# Altium project BRD4270Z.PrjPcb
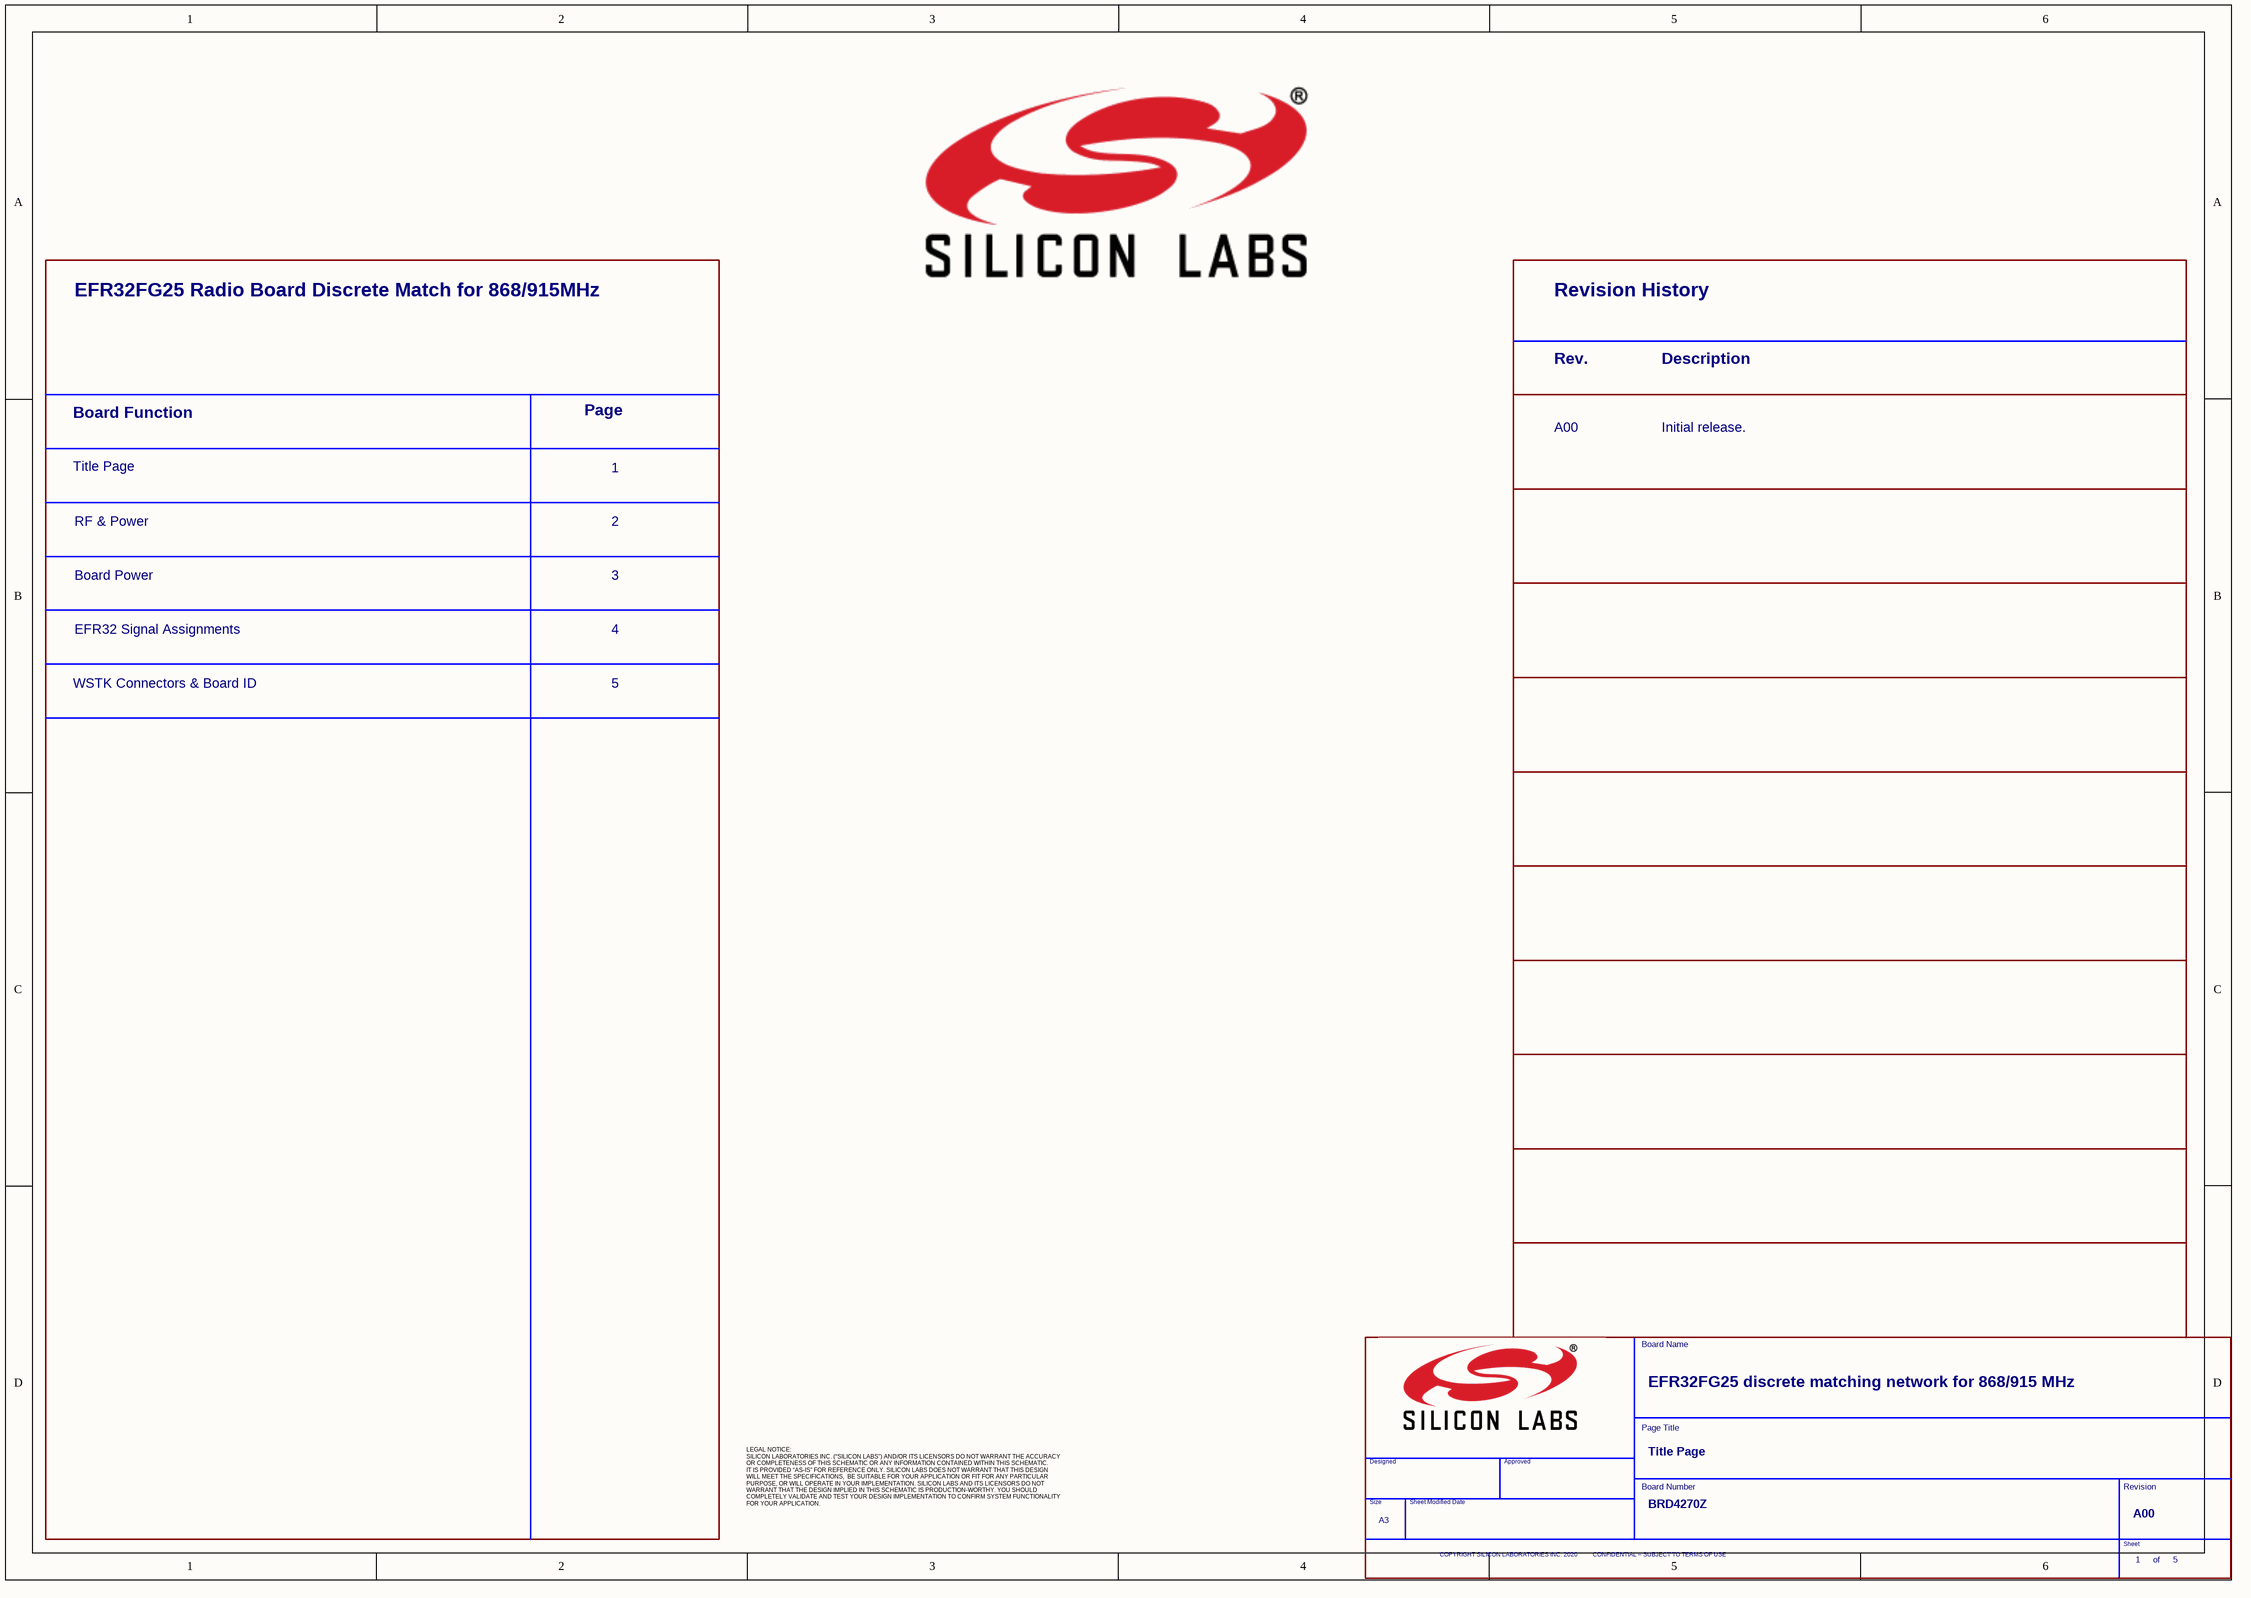
[diagram p0: 01_ Title Page.SchDoc]
5 sheets, 112 parts. Net scope: global (net labels, ports and power ports of the same name join across sheets).
Board file: PCB4270Z_A00.PcbDoc
Sheets:
  01_ Title Page.SchDoc
  02_ RF & Power.SchDoc
  03_ Board Power.SchDoc
  04_ EFR32 Signal Assign.SchDoc
  05_ WSTK Connectors & B.SchDoc

## Sheet 01_ Title Page.SchDoc
size 420 x 297 mm

### Parts
(Parts that share a designator on the sheet are numbered #1, #2 ... from top to bottom, then left to right.)
*#1  Header A: EFR32FG25 Radio Board Discrete Match for 868/915MHz  (hidden comment: Toc_Header)  (graphical)
*#2  Rev1: A00  Dscr1A: Initial release.  (hidden comment: Rev_History)  (graphical)
*#3  Title: EFR32FG25 discrete matching network for 868/915 MHz  Page Count: 5  Page Number: 1  Page Size: A3  Page Title: Title Page  Board Number: BRD4270Z  RevCode: A00  (hidden comment: TitleBlock_SiliconLabs_A3)  (graphical)

### Notes on the sheet
- Board Function
- Page
- Title Page
- RF & Power
- 1
- 2
- Board Power
- 3
- EFR32 Signal Assignments
- 4
- WSTK Connectors & Board ID
- 5
- LEGAL NOTICE:
  SILICON LABORATORIES INC. (“SILICON LABS”) AND/OR ITS LICENSORS DO NOT WARRANT THE ACCURACY
  OR COMPLETENESS OF THIS SCHEMATIC OR ANY INFORMATION CONTAINED WITHIN THIS SCHEMATIC.
  IT IS PROVIDED “AS-IS” FOR REFERENCE ONLY. SILICON LABS DOES NOT WARRANT THAT THIS DESIGN
  WILL MEET THE SPECIFICATIONS,  BE SUITABLE FOR YOUR APPLICATION OR FIT FOR ANY PARTICULAR
  PURPOSE, OR WILL OPERATE IN YOUR IMPLEMENTATION. SILICON LABS AND ITS LICENSORS DO NOT
  WARRANT THAT THE DESIGN IMPLIED IN THIS SCHEMATIC IS PRODUCTION-WORTHY. YOU SHOULD
  COMPLETELY VALIDATE AND TEST YOUR DESIGN IMPLEMENTATION TO CONFIRM SYSTEM FUNCTIONALITY
  FOR YOUR APPLICATION.
- (in symbol Rev_History) Revision History; Rev.; Description
- (in symbol TitleBlock_SiliconLabs_A3) Board Name; Page Title; Designed; Approved; Board Number; Revision; Size; Sheet Modified Date; Sheet; COPYRIGHT SILICON LABORATORIES INC. 2020          CONFIDENTIAL – SUBJECT TO TERMS OF USE; of

### Library data of the parts
*#2 = Rev_History: RevCode: PA00*
*#3 = TitleBlock_SiliconLabs_A3: OrgName: Silicon Labs

## Sheet 02_ RF & Power.SchDoc
size 420 x 297 mm
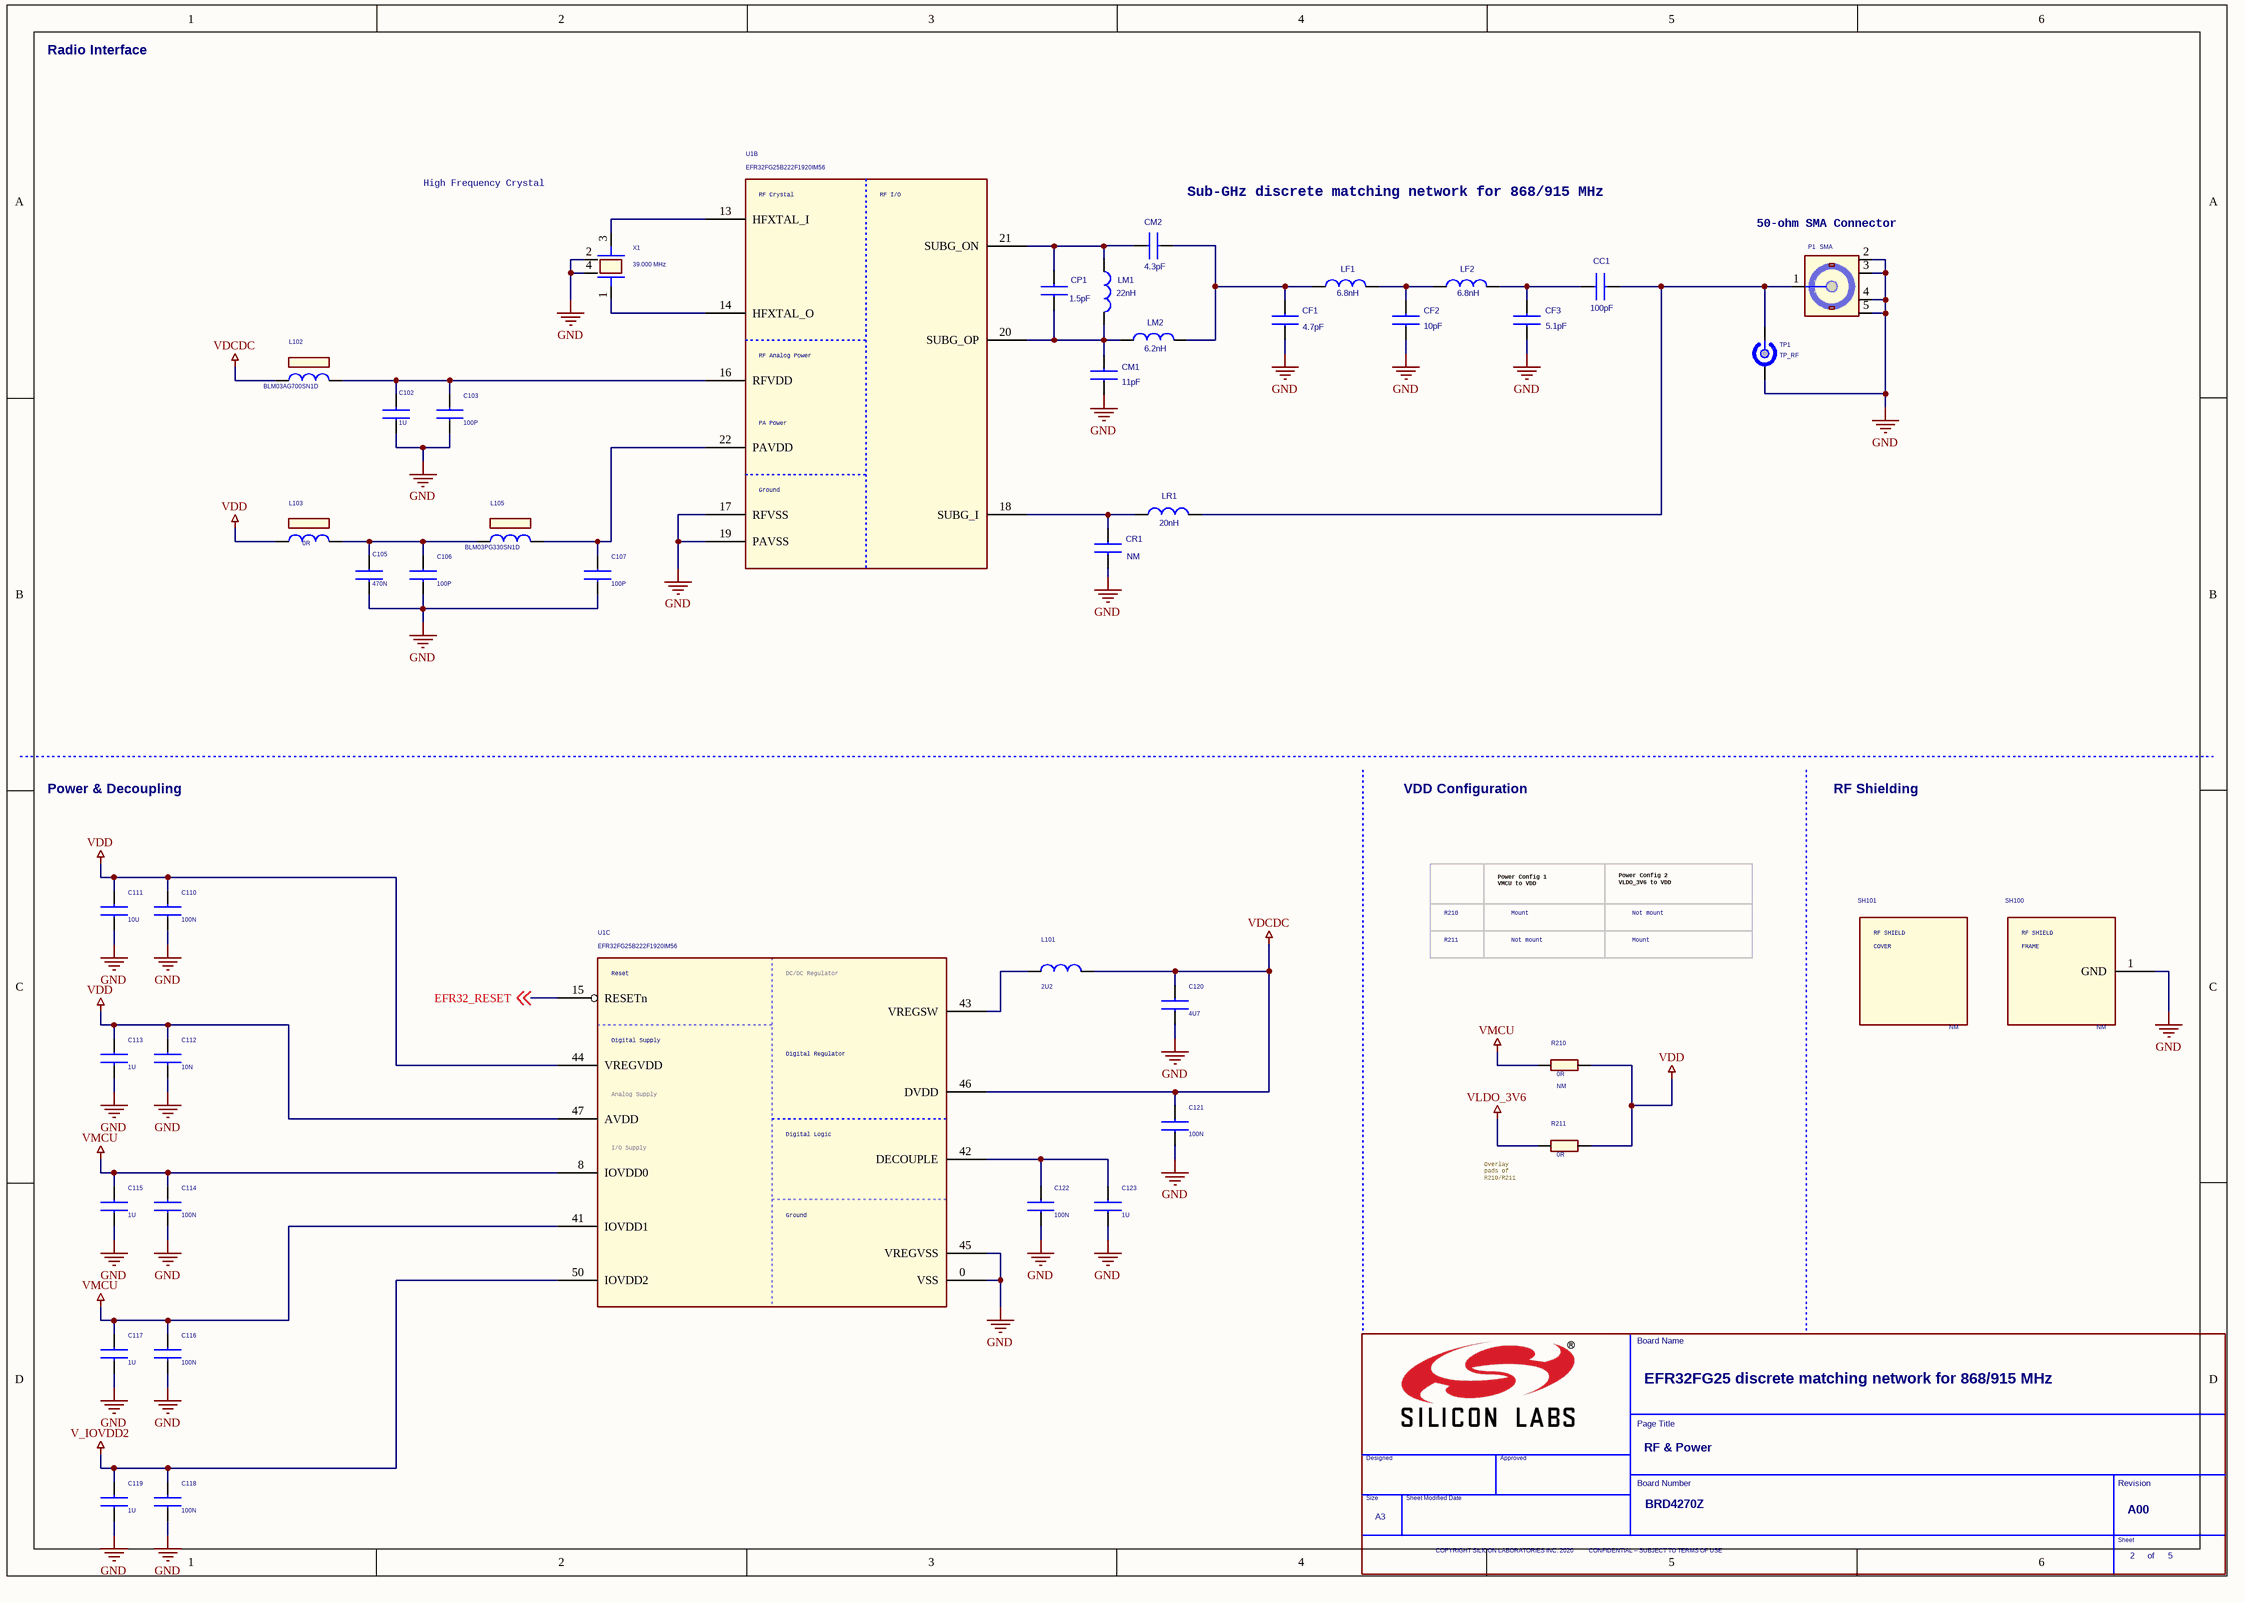
[diagram p1: 02_ RF & Power.SchDoc]

### Parts
(Parts that share a designator on the sheet are numbered #1, #2 ... from top to bottom, then left to right.)
*#4  Title: EFR32FG25 discrete matching network for 868/915 MHz  Page Count: 5  Page Number: 2  Page Size: A3  Page Title: RF & Power  Board Number: BRD4270Z  RevCode: A00  (hidden comment: TitleBlock_SiliconLabs_A3)  (graphical)
C102  1U  [C0402_L]
C103  100P  [C0201_L]
C105  470N  [C0402_L]
C106  100P  [C0201_L]
C107  100P  [C0201_L]
C110  100N  [C0201_L]
C111  10U  [C0603_L]
C112  10N  [C0201_L]
C113  1U  [C0402_L]
C114  100N  [C0201_L]
C115  1U  [C0402_L]
C116  100N  [C0201_L]
C117  1U  [C0402_L]
C118  100N  [C0201_L]
C119  1U  [C0402_L]
C120  4U7  [C0603_L]
C121  100N  [C0201_L]
C122  100N  [C0201_L]
C123  1U  [C0402_L]
CC1  100pF  [C0201_L]
CF1  4.7pF  [C0201_L]
CF2  10pF  [C0201_L]
CF3  5.1pF  [C0201_L]
CM1  11pF  [C0201_L]
CM2  4.3pF  [C0201_L]
CP1  1.5pF  [C0201_L]
CR1  Not Mounted: NM  [C0201_L]  (hidden comment: Unused)
L101  2U2  [COIL_1008_L]
L102  BLM03AG700SN1D  [COIL_MUR_BLM03_0201]
L103  0R  [COIL_MUR_BLM03_0201]
L105  BLM03PG330SN1D  [COIL_MUR_BLM03_0201]
LF1  6.8nH  [COIL_0201_L]
LF2  6.8nH  [COIL_0201_L]
LM1  22nH  [COIL_0201_L]
LM2  6.2nH  [COIL_0201_L]
LR1  20nH  [COIL_0201_L]
P1  SMA  [TE_SMA_1814832_TH_VER]
R210  0R  Not Mounted: NM  [R0402_L]
R211  0R  [R0402_L]
SH100  Not Mounted: NM  [LAIRD_BMI-S-203-F]  (hidden comment: RF_SHIELD_FRAME_BMI-S-203-F)
SH101  Not Mounted: NM  (hidden comment: RF_SHIELD_COVER_BMI-S-203-C)
TP1  TP_RF  [TP_INGUN_50OHM_PARTIAL]
U1  EFR32FG25B222F1920IM56  [QFN56_M040_7.0X7.0_EP_SL]  (parts B,C of 3)
X1  39.000 MHz  [X_SSS_DSX211SH_2.05X1.65-4]

### Nets
GND: C102.2 C103.2 C105.2 C106.2 C107.2 C110.2 C111.2 C112.2 C113.2 C114.2 C115.2 C116.2 C117.2 C118.2 C119.2 C120.2 C121.2 C122.2 C123.2 CF1.2 CF2.2 CF3.2 CM1.2 CR1.2 P1.2(GND1) P1.3(GND2) P1.4(GND3) P1.5(GND4) SH100.1(GND) TP1.2(GND) U1.0(VSS) U1.17(RFVSS) U1.19(PAVSS) U1.45(VREGVSS) X1.2 X1.4
V_IOVDD2: C118.1 C119.1 U1.50(IOVDD2)
VDCDC: C120.1 C121.1 L101.2 L102.1 U1.46(DVDD)
VDD: C110.1 C111.1 C112.1 C113.1 L103.1 R210.2 R211.2 U1.44(VREGVDD) U1.47(AVDD)
VLDO_3V6: R211.1
VMCU: C114.1 C115.1 C116.1 C117.1 R210.1 U1.8(IOVDD0) U1.41(IOVDD1)
EFR32_RESET: U1.15(RESETn) ; off-sheet EFR32_RESET  [project net DBG_RESET]
NetC102_1: C102.1 C103.1 L102.2 U1.16(RFVDD)
NetC105_1: C105.1 C106.1 L103.2 L105.1
NetC107_1: C107.1 L105.2 U1.22(PAVDD)
NetC122_1: C122.1 C123.1 U1.42(DECOUPLE)
NetCC1_1: CC1.1 CF3.1 LF2.2
NetCC1_2: CC1.2 LR1.2 P1.1(SIGNAL) TP1.1(RF)
NetCF1_1: CF1.1 CM2.2 LF1.1 LM2.2
NetCF2_1: CF2.1 LF1.2 LF2.1
NetCM1_1: CM1.1 CP1.2 LM1.2 LM2.1 U1.20(SUBG_OP)
NetCM2_1: CM2.1 CP1.1 LM1.1 U1.21(SUBG_ON)
NetCR1_1: CR1.1 LR1.1 U1.18(SUBG_I)
NetL101_1: L101.1 U1.43(VREGSW)
NetU1_13: U1.13(HFXTAL_I) X1.3
NetU1_14: U1.14(HFXTAL_O) X1.1

### Notes on the sheet
- Radio Interface
- High Frequency Crystal
- (near CM2) Sub-GHz discrete matching network for 868/915 MHz
- (near P1) 50-ohm SMA Connector
- Power & Decoupling
- VDD Configuration
- RF Shielding
- R210
- Power Config 1
  VMCU to VDD
- Mount
- Power Config 2
  VLDO_3V6 to VDD
- Not mount
- R211
- (near R211) Overlay
  pads of
  R210/R211
- (in symbol EFR32xG25_QFN56_HFCLKOUT, part B) RF Crystal; RF I/O; RF Analog Power; PA Power; Ground
- (in symbol EFR32xG25_QFN56_HFCLKOUT, part C) Reset; DC/DC Regulator; Digital Supply; Digital Regulator; Analog Supply; Digital Logic; I/O Supply; Ground
- (in symbol RF_SHIELD_COVER_BMI-S-203-C) RF SHIELD; COVER
- (in symbol RF_SHIELD_FRAME_BMI-S-203-F) RF SHIELD; FRAME
- (in symbol TitleBlock_SiliconLabs_A3) Board Name; Page Title; Designed; Approved; Board Number; Revision; Size; Sheet Modified Date; Sheet; COPYRIGHT SILICON LABORATORIES INC. 2020          CONFIDENTIAL – SUBJECT TO TERMS OF USE; of

### Library data of the parts
*#4 = TitleBlock_SiliconLabs_A3: Board Approver: RGU; OrgName: Silicon Labs
C102 C113 C115 C117 C119 C123 = C0402: Rating: 6.3V; Tolerance: 10%; Technology: X7R
C103 C106 C107 = C0201: Rating: 25V; Tolerance: 5%; Technology: C0G
C105 = C0402: Rating: 10V; Tolerance: 10%; Technology: X7R
C110 C114 C116 C118 C121 C122 = C0201: Rating: 16V; Tolerance: 20%; Technology: X7S
C111 = C0603: Rating: 6.3V; Tolerance: 20%; Technology: X7R
C112 = C0201: Rating: 16V; Tolerance: 10%; Technology: X7R
C120 = C0603: Rating: 6.3V; Tolerance: 10%; Technology: X7R
CC1 CM2 CR1 = C0201: Tolerance: ±0.05P; Mfg: Murata; Technology: C0G
CF1 CP1 = C0201: Tolerance: ±0.1P; Mfg: Murata; Mfg #: GRM0335C1H3R8BA01D; Technology: C0G
CF2 = C0201: Tolerance: ±0.1P; Mfg: Murata; Mfg #: GRM0335C1H4R0BA01D; Technology: C0G
CF3 = C0201: Tolerance: ±0.05P; Mfg: Murata; Mfg #: GRM0335C1H2R8WA01D; Technology: C0G
CM1 = C0201: Tolerance: ±0.1P; Mfg: Murata; Mfg #: GRM0335C1H9R4BA01D; Technology: C0G
L101 = L1008: Mfg: Murata; Mfg #: DFE2HCAH2R2MJ0L; Tolerance: +/-20%
L102 L105 = BLM03AX: Mfg: Murata; Price_1K: 0.05
  L102: Mfg #: BLM03AG700SN1D
  L105: Mfg #: BLM03PG330SN1D
L103 = BLM03AX: Price_1K: 0.05
LF1 = L0201: Tolerance: ±3%; Mfg #: LQP03HQ6N2H02D; Mfg: Murata
LF2 = L0201: Tolerance: ±3%; Mfg #: LQP03HQ8N2H02D; Mfg: Murata
LM1 = L0201: Tolerance: ±0.1N; Mfg #: LQP03HQ1N6B02D; Mfg: Murata
LM2 = L0201
LR1 = L0201: Tolerance: ±3%; Mfg #: LQP03HQ16NH02D; Mfg: Murata
P1 = SMA_TH_WELLSHOW: Mfg #: C02AN31P00101; Mfg: Wellshow; Price_1K: 1.46
R210 R211 = R0402: Price_1K: 0.005
SH100 = RF_SHIELD_FRAME_BMI-S-203-F: Mfg: Laird Technologies; Footprint: Laird_BMI-S-203-F; Mfg #: BMI-S-203-F; Price_1k: 1.148
SH101 = RF_SHIELD_COVER_BMI-S-203-C: Mfg: Laird Technologies; Price_1k: 0.814; Mfg #: BMI-S-203-C
U1 = EFR32xG25_QFN56_HFCLKOUT: MFG #: EFR32FG25B222F1920IM56-AR; MFG: Silicon Labs
X1 = DSX211SH: Mfg: Tai-Saw; Mfg #: TZ3541C; Price_1K: 0.512

## Sheet 03_ Board Power.SchDoc
size 420 x 297 mm
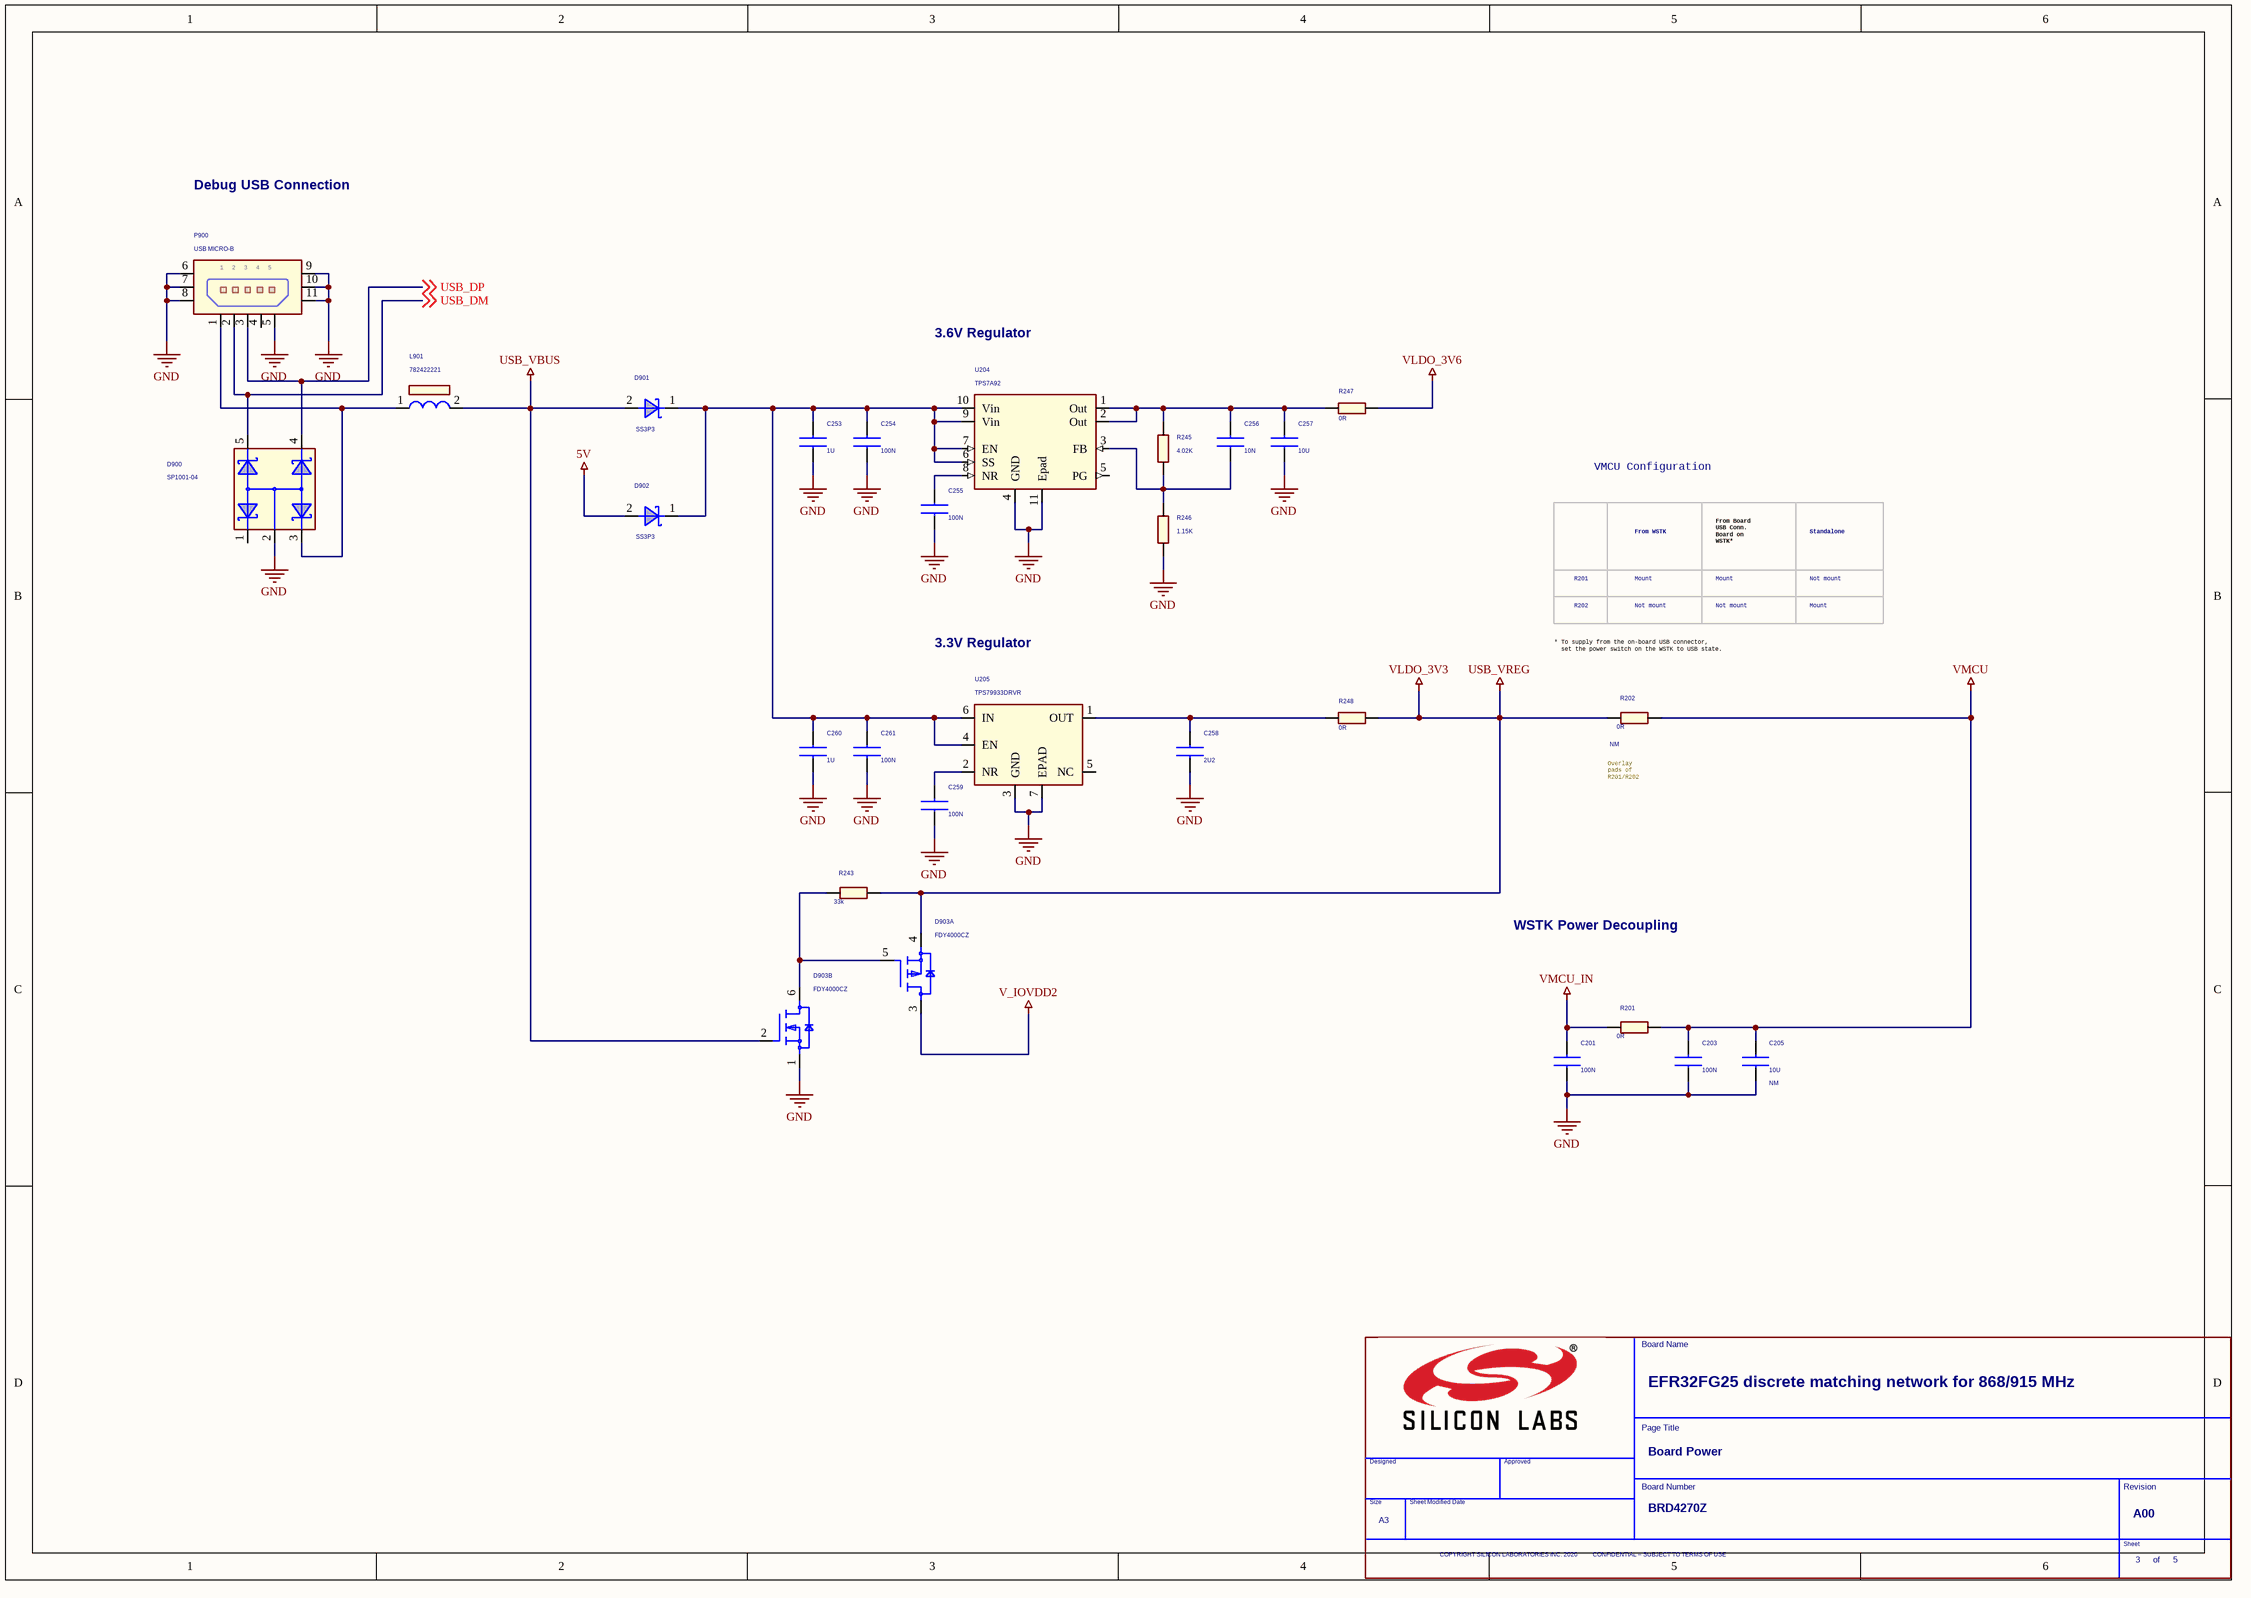
[diagram p2: 03_ Board Power.SchDoc]

### Parts
(Parts that share a designator on the sheet are numbered #1, #2 ... from top to bottom, then left to right.)
*#5  Title: EFR32FG25 discrete matching network for 868/915 MHz  Page Count: 5  Page Number: 3  Page Size: A3  Page Title: Board Power  Board Number: BRD4270Z  RevCode: A00  (hidden comment: TitleBlock_SiliconLabs_A3)  (graphical)
C201  100N  [C0201_L]
C203  100N  [C0201_L]
C205  10U  Not Mounted: NM  [T_UNDEF]
C253  1U  [C0402_L]
C254  100N  [C0201_L]
C255  100N  [C0201_L]
C256  10N  [C0201_L]
C257  10U  [C0402_L]
C258  2U2  [C0402_L]
C259  100N  [C0201_L]
C260  1U  [C0402_L]
C261  100N  [C0201_L]
D900  SP1001-04  [SOT553_L]
D901  SS3P3  [DO-220AA]
D902  SS3P3  [DO-220AA]
D903  FDY4000CZ  [SOT-563]  (parts A,B of 2)
L901  782422221  [COIL_0402]
P900  USB MICRO-B  [KLS_L-KLS1-238-0-X-0-X]
R201  0R  [R0402_L]
R202  0R  Not Mounted: NM  [R0402_L]
R243  33k  [R0402_L]
R245  4.02K  [R0201_L]
R246  1.15K  [R0201_L]
R247  0R  [R0603_L]
R248  0R  [R0603_L]
U204  TPS7A92  [WFDFN-10_EP_TPS7A92]
U205  TPS79933DRVR  [SON-6_EP_TPS79933DDCR]

### Nets
5V: D902.2(Anode)
GND: C201.2 C203.2 C205.2 C253.2 C254.2 C255.2 C257.2 C258.2 C259.2 C260.2 C261.2 D900.2 D903.1(S1) P900.5 P900.6 P900.7 P900.8 P900.9 P900.10 P900.11 R246.1 U204.4(GND) U204.11(Epad) U205.3(GND) U205.7(EPAD)
USB_VBUS: D901.2(Anode) D903.2(G1) L901.2
USB_VREG: D903.4(S2) R202.2 R243.1 R248.2  [also labelled VLDO_3V3]
V_IOVDD2: D903.3(D2)
VLDO_3V6: R247.2
VMCU: C203.1 C205.1 R201.1 R202.1
VMCU_IN: C201.1 R201.2
USB_DM: D900.5 P900.2 ; off-sheet USB_DM  [project net EFR32_PD07]
USB_DP: D900.4 P900.3 ; off-sheet USB_DP  [project net EFR32_PD06]
NetC253_1: C253.1 C254.1 C260.1 C261.1 D901.1(Cathode) D902.1(Cathode) U204.6(SS) U204.7(EN) U204.9(Vin) U204.10(Vin) U205.4(EN) U205.6(IN)
NetC255_1: C255.1 U204.8(NR)
NetC256_1: C256.1 C257.1 R245.2 R247.1 U204.1(Out) U204.2(Out)
NetC256_2: C256.2 R245.1 R246.2 U204.3(FB)
NetC258_1: C258.1 R248.1 U205.1(OUT)
NetC259_1: C259.1 U205.2(NR)
NetD900_3: D900.3 L901.1 P900.1
NetD903_5: D903.5(G5) D903.6(D1) R243.2

Not connected (* = marked no-connect by the designer): D900 1; P900 4; U204 5(PG); U205 5(NC)

### Notes on the sheet
- Debug USB Connection
- 3.6V Regulator
- VMCU Configuration
- From WSTK
- Standalone
- R201
- Mount
- From Board
  USB Conn.
  Board on
  WSTK*
- Not mount
- 3.3V Regulator
- * To supply from the on-board USB connector,
  set the power switch on the WSTK to USB state.
- R202
- (near R202) Overlay
  pads of
  R201/R202
- WSTK Power Decoupling
- (in symbol TitleBlock_SiliconLabs_A3) Board Name; Page Title; Designed; Approved; Board Number; Revision; Size; Sheet Modified Date; Sheet; COPYRIGHT SILICON LABORATORIES INC. 2020          CONFIDENTIAL – SUBJECT TO TERMS OF USE; of

### Library data of the parts
*#5 = TitleBlock_SiliconLabs_A3: Board Approver: RGU; OrgName: Silicon Labs
C201 C203 C254 C255 C259 C261 = C0201: Rating: 16V; Tolerance: 20%; Technology: X7S
C205 = CAPACITOR: Technology: X7R
C253 C258 C260 = C0402: Rating: 6.3V; Tolerance: 10%
  C253 C260: Technology: X7R
  C258: Technology: X7S
C256 = C0201: Rating: 16V; Tolerance: 10%; Technology: X7R
C257 = C0402: Rating: 6.3V; Tolerance: 20%; Technology: X6S
D900 = SP1001-04: Mfg: Littlefuse; Mfg #: SP1001-04XTG; Price_1K: 0.187
D901 D902 = SS3P3: Mfg: Vishay; Mfg #: SS3P3-M3/84A; Price_1K: 0.12
D903 = FDY4000CZ: Mfg: ON Semiconductor; Mfg #: FDY4000CZ
L901 = WE-CBA: Mfg: Würth Elektronik; Price_1K: 0.02; Mfg #: 782422221
P900 = KLS L-KLS1-238-0-0-0: Mfg: KLS; Mfg #: L-KLS1-238-0-0-0-R; Price_1K: 0.20
R201 R202 R243 = R0402: Price_1K: 0.005
R245 R246 = R0201: Price_1K: 0.005
R247 R248 = R0603: Price_1K: 0.005
U204 = TPS7A92: Mfg #: TPS7A9201DSKR; Mfg: Texas Instruments; Price 1k: 1.2
U205 = TPS79933DRVR: Mfg: Texas Instruments; Price 1k: 0.38; Mfg #: TPS79933DRVR

## Sheet 04_ EFR32 Signal Assign.SchDoc
size 420 x 297 mm
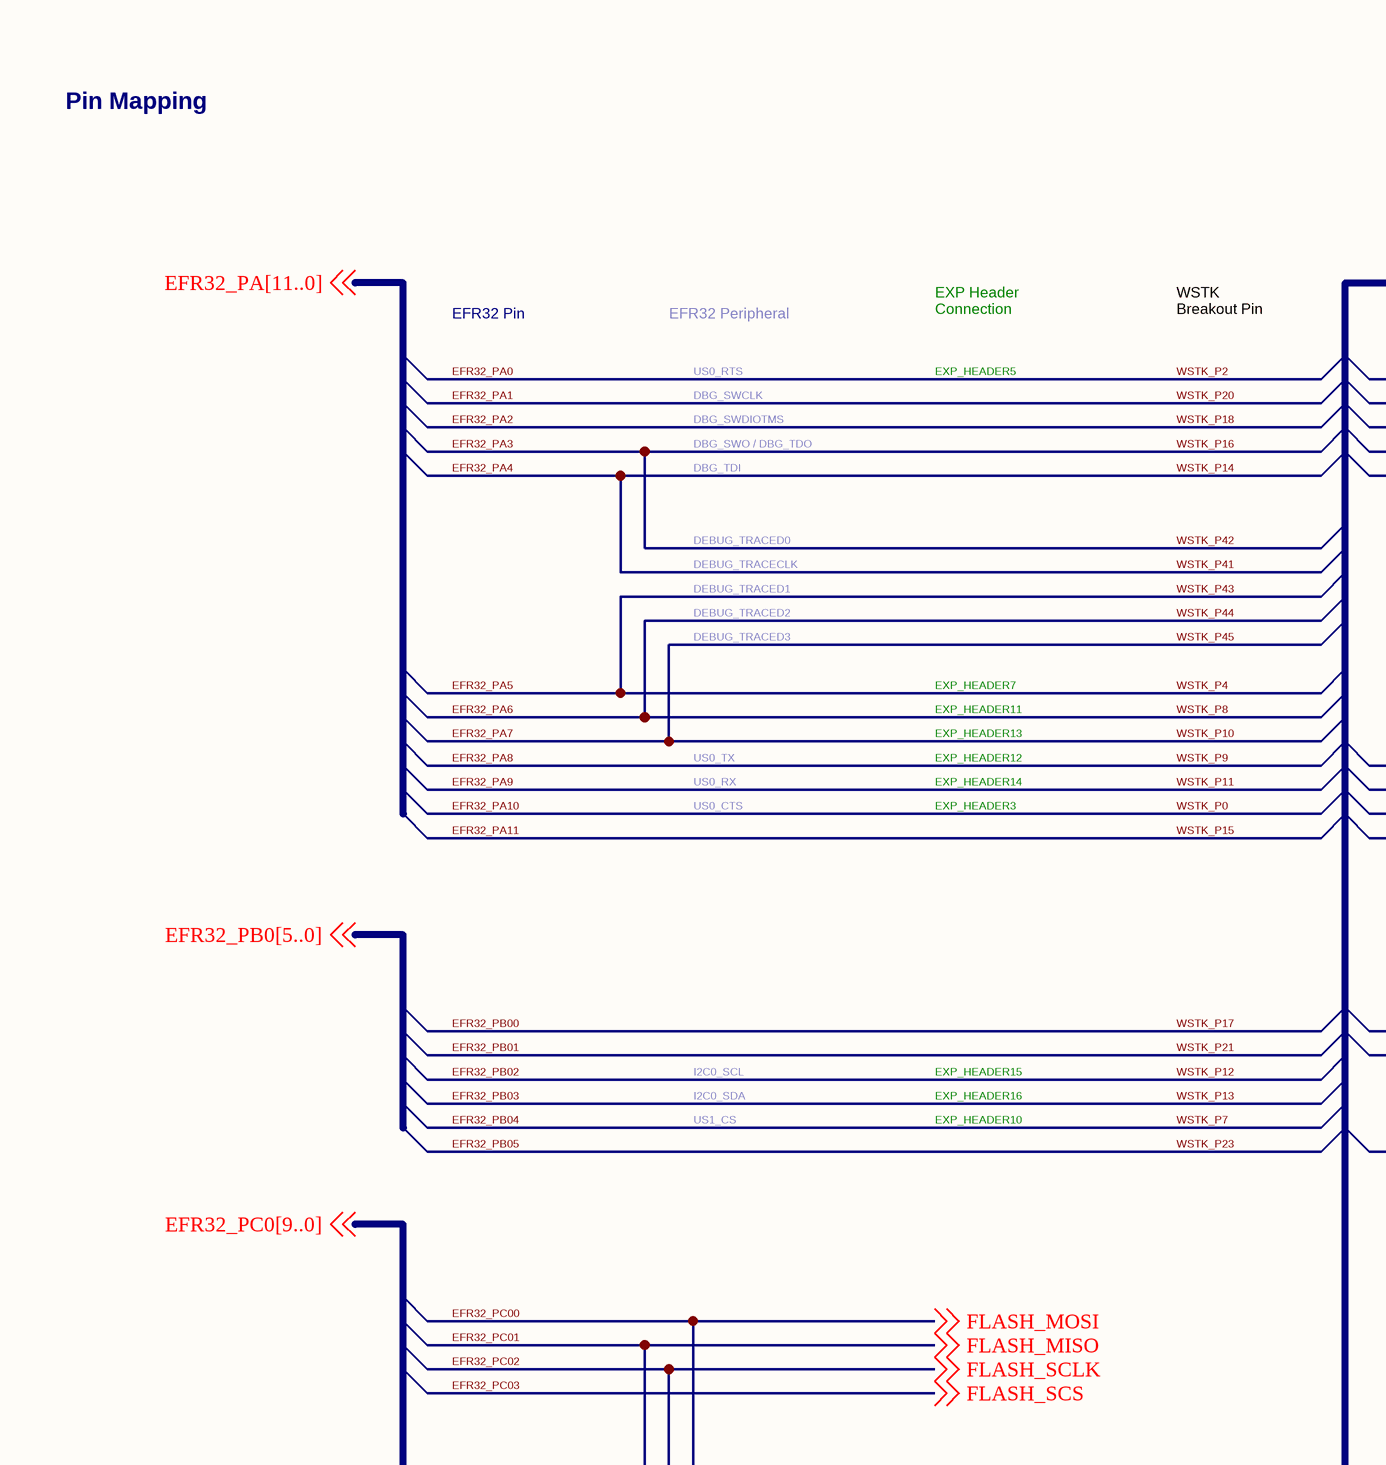
[diagram p3: 04_ EFR32 Signal Assign.SchDoc, top left]
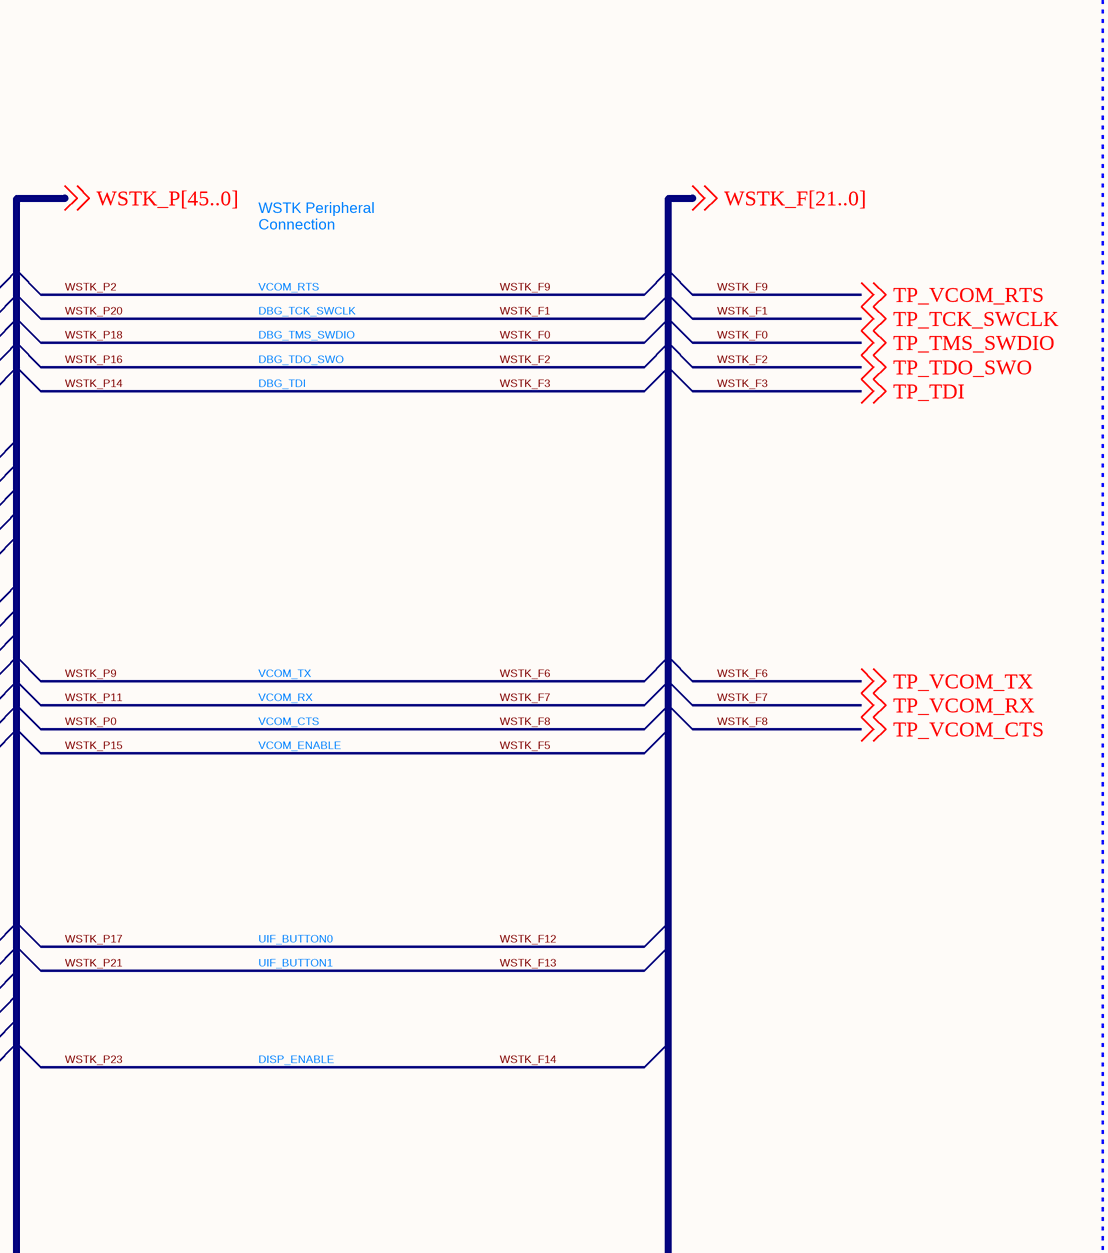
[diagram p4: 04_ EFR32 Signal Assign.SchDoc, top middle]
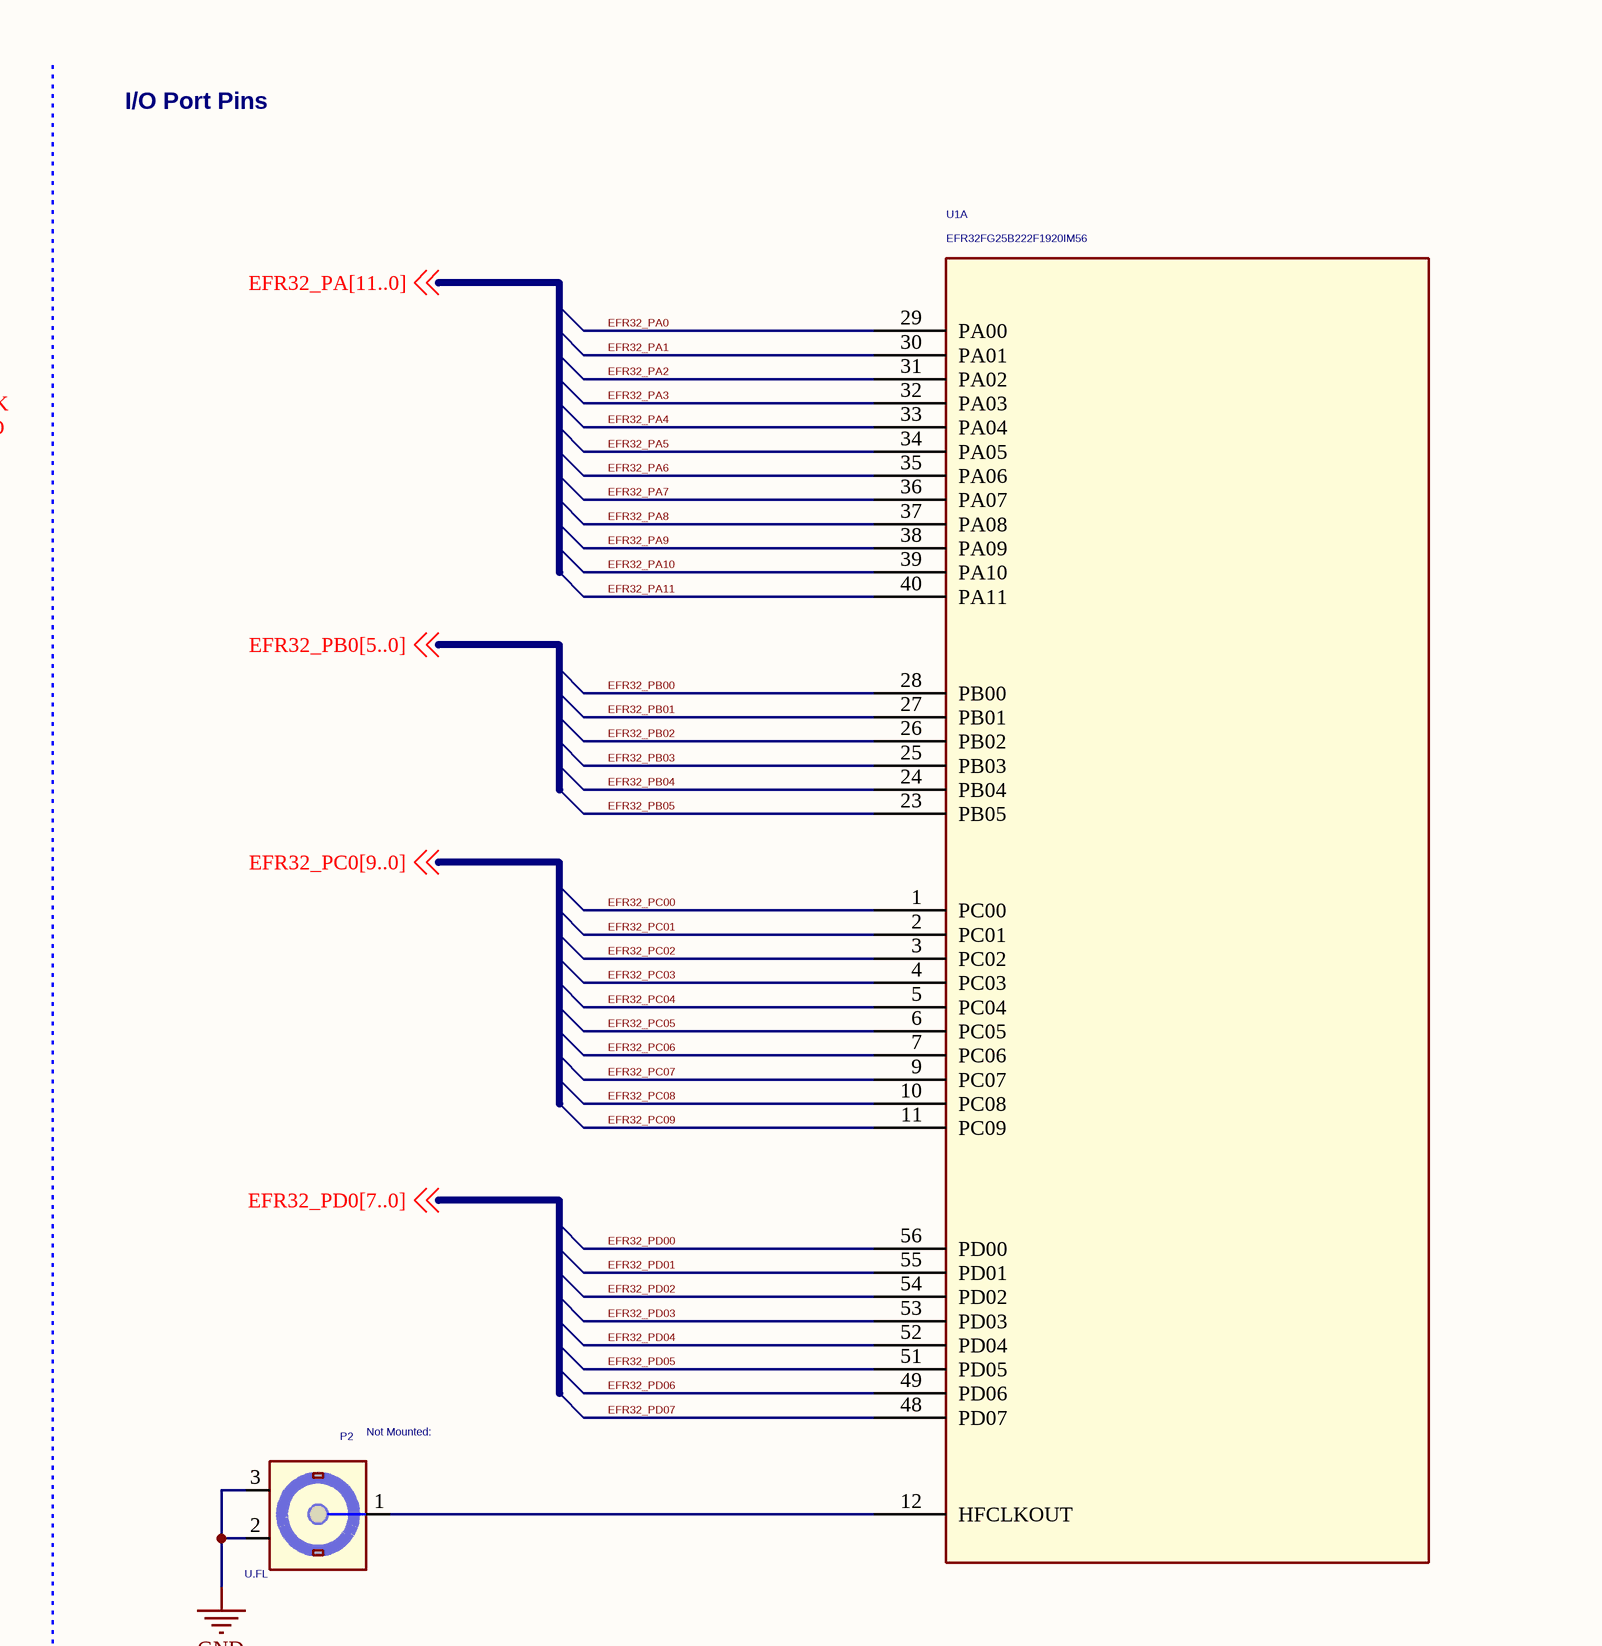
[diagram p5: 04_ EFR32 Signal Assign.SchDoc, top right]
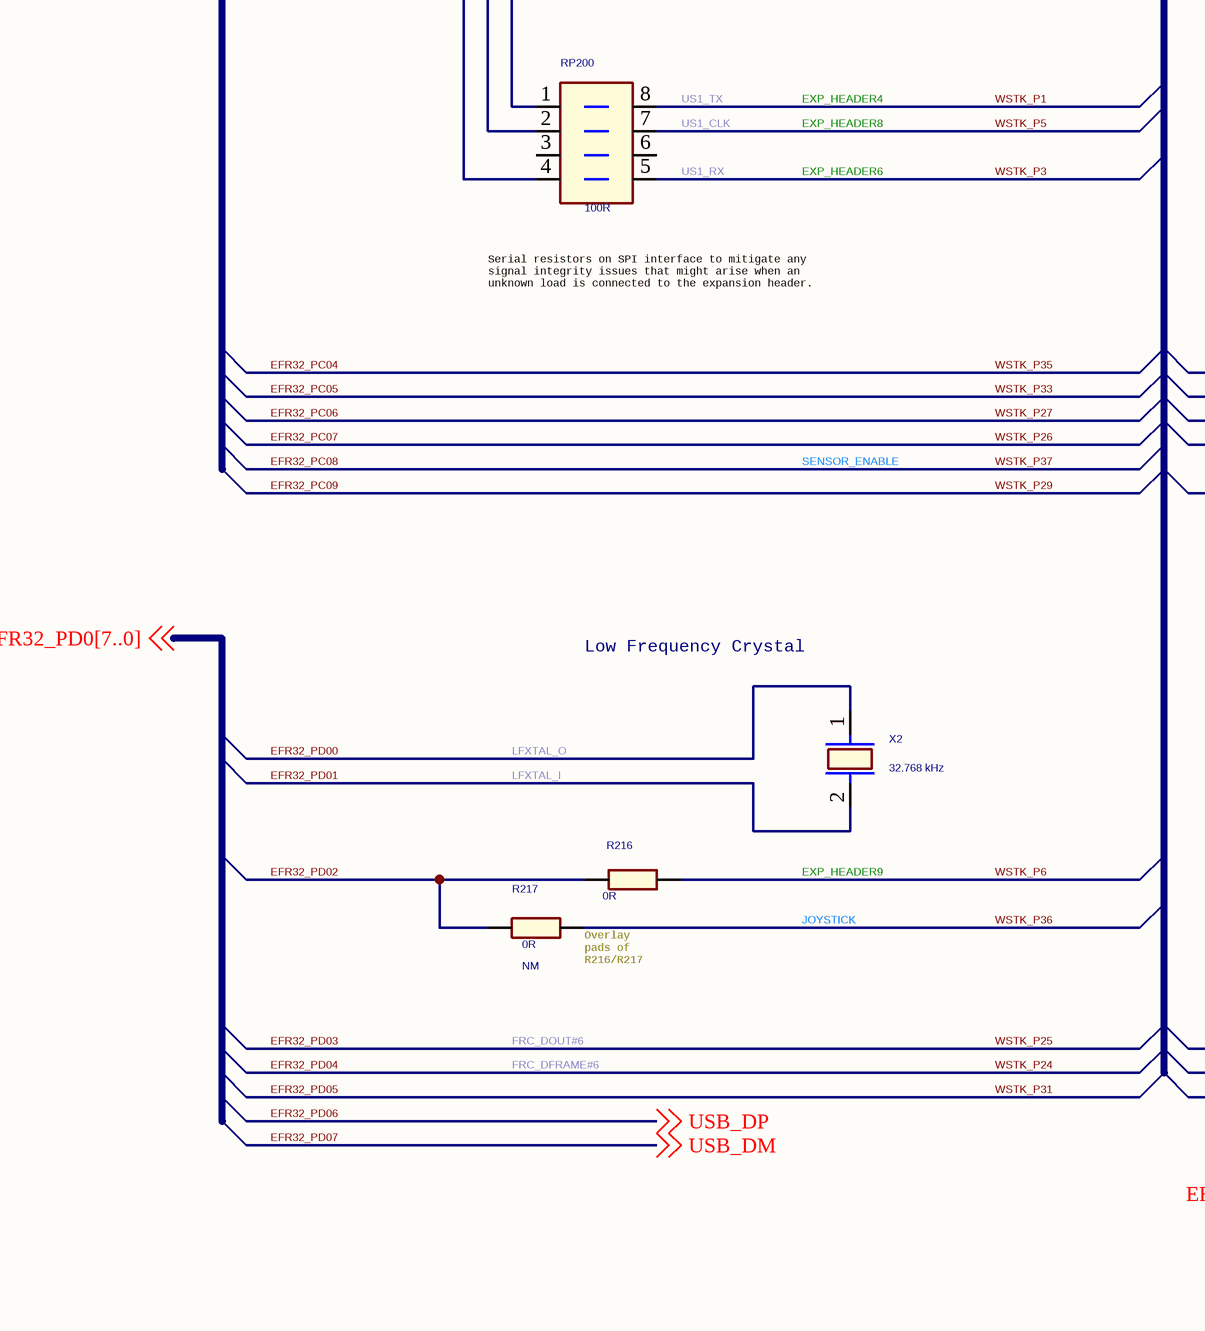
[diagram p6: 04_ EFR32 Signal Assign.SchDoc, bottom left]
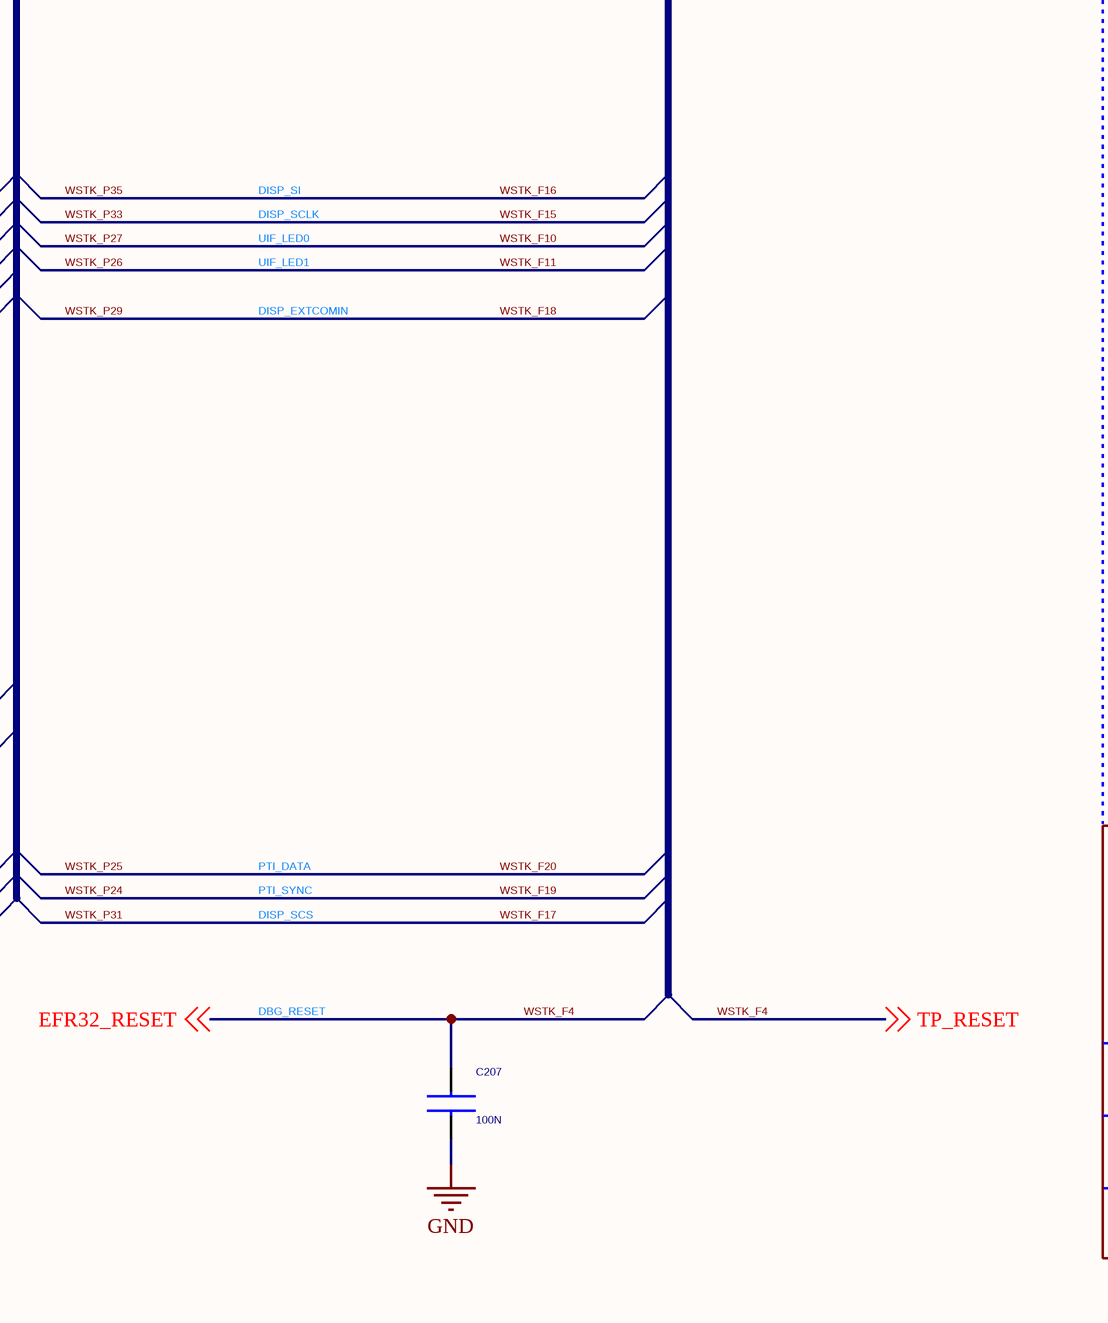
[diagram p7: 04_ EFR32 Signal Assign.SchDoc, bottom middle]
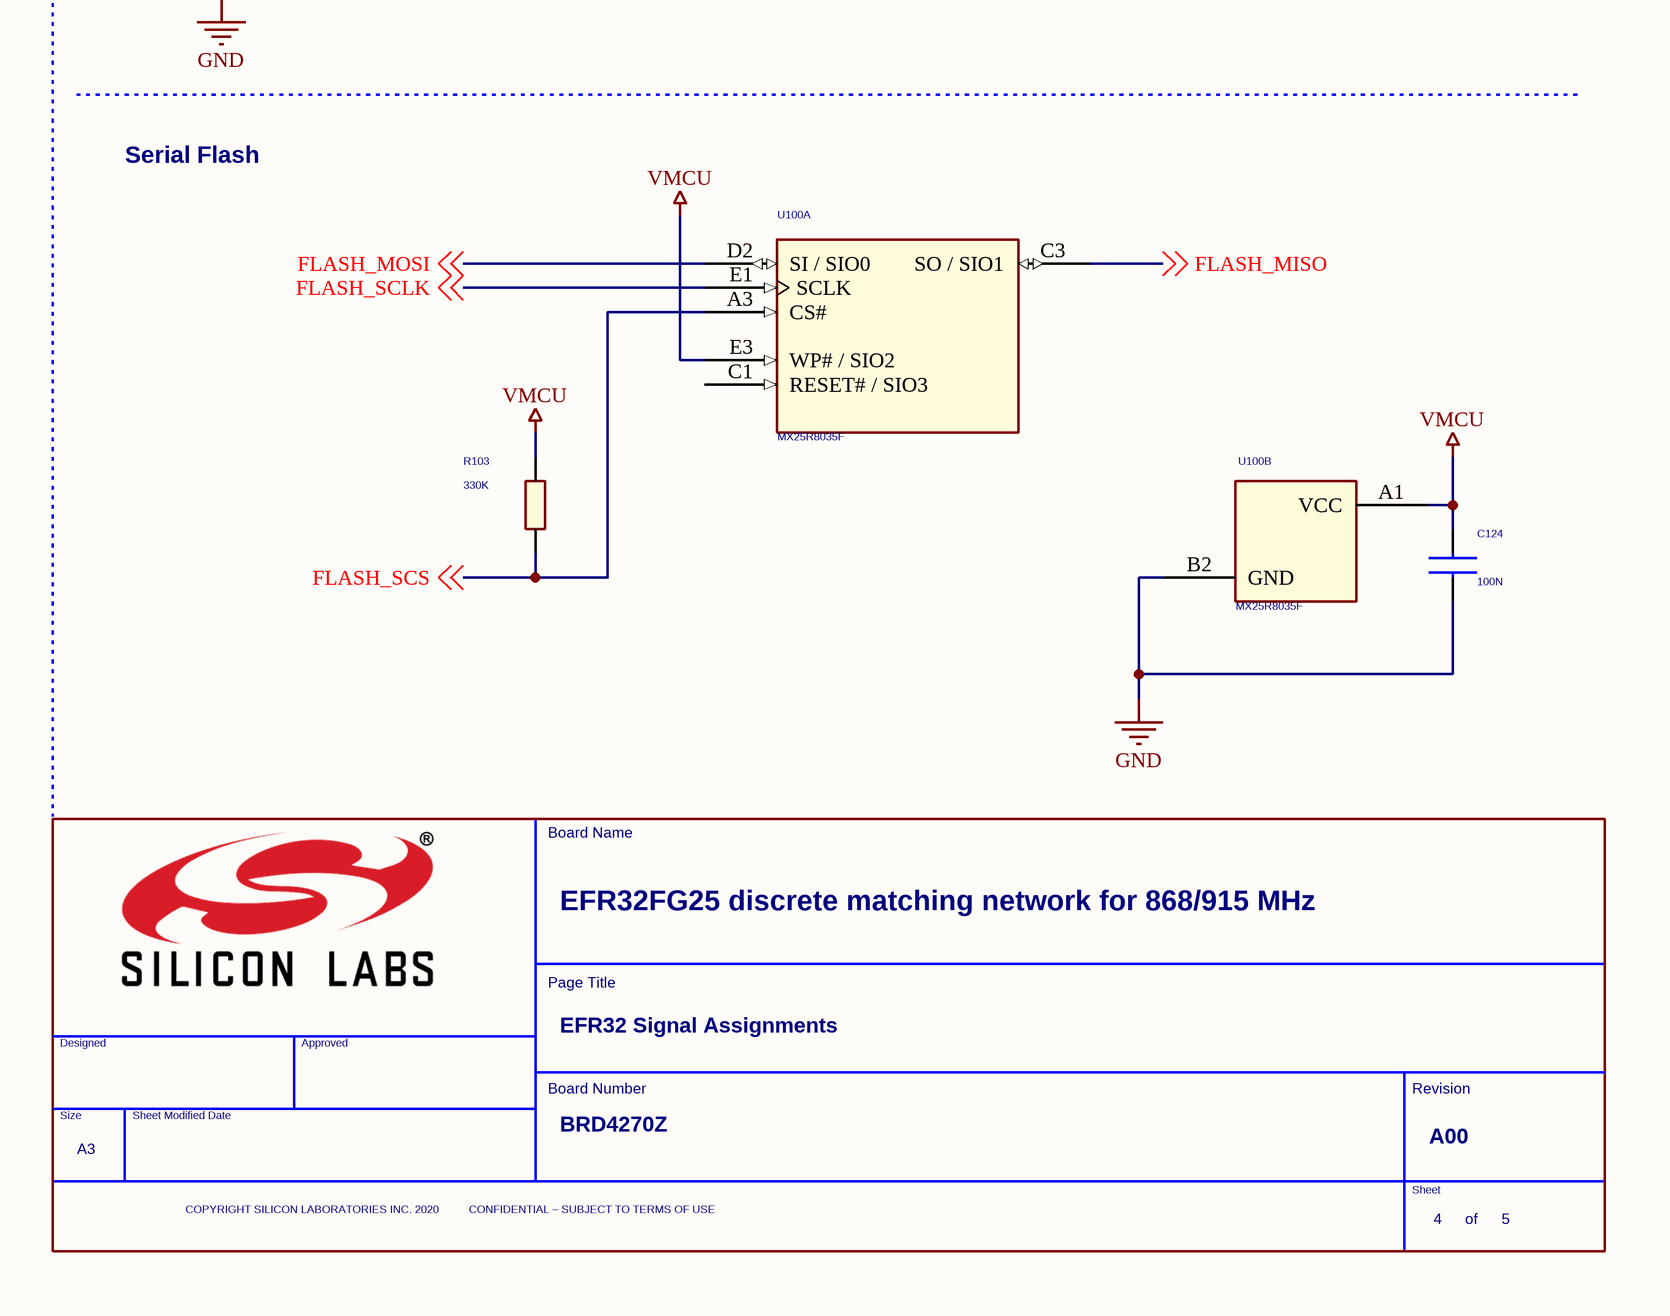
[diagram p8: 04_ EFR32 Signal Assign.SchDoc, bottom right]

### Parts
(Parts that share a designator on the sheet are numbered #1, #2 ... from top to bottom, then left to right.)
*#6  Title: EFR32FG25 discrete matching network for 868/915 MHz  Page Count: 5  Page Number: 4  Page Size: A3  Page Title: EFR32 Signal Assignments  Board Number: BRD4270Z  RevCode: A00  (hidden comment: TitleBlock_SiliconLabs_A3)  (graphical)
C124  100N  [C0201_L]
C207  100N  [C0201_L]
P2  U.FL  [HIROSE_U.FL-R-SMT-1]
R103  330K  [R0201_L]
R216  0R  [R0402_L]
R217  0R  Not Mounted: NM  [R0402_L]
RP200  100R  [RES_MNR04-8]
U1  EFR32FG25B222F1920IM56  [QFN56_M040_7.0X7.0_EP_SL]  (part A of 3)
U100  MX25R8035F  [BGA8_M040_1.24x1.75_WLCSP]  (parts A,B of 2)
X2  32.768 kHz  [X_MCS_CM8V-T1A]

### Nets
GND: C124.2 C207.2 P2.2(GND1) P2.3(GND4) U100.B2(GND)
VMCU: C124.1 R103.2 U100.A1(VCC) U100.E3(WP#_/_SIO2)
DBG_RESET: C207.1 ; off-sheet EFR32_RESET, off-sheet TP_RESET  [also labelled EFR32_RESET, TP_RESET, WSTK_F4]
DBG_SWCLK: U1.30(PA01) ; off-sheet TP_TCK_SWCLK  [also labelled DBG_TCK_SWCLK, EFR32_PA1, TP_TCK_SWCLK, WSTK_F1, WSTK_P20]
DBG_SWDIOTMS: U1.31(PA02) ; off-sheet TP_TMS_SWDIO  [also labelled DBG_TMS_SWDIO, EFR32_PA2, TP_TMS_SWDIO, WSTK_F0, WSTK_P18]
DBG_SWO / DBG_TDO: U1.32(PA03) ; off-sheet TP_TDO_SWO  [also labelled DBG_TDO_SWO, DEBUG_TRACED0, EFR32_PA3, TP_TDO_SWO, WSTK_F2, WSTK_P16, WSTK_P42]
DBG_TDI: U1.33(PA04) ; off-sheet TP_TDI  [also labelled DEBUG_TRACECLK, EFR32_PA4, TP_TDI, WSTK_F3, WSTK_P14, WSTK_P41]
DEBUG_TRACED1: U1.34(PA05)  [also labelled EFR32_PA5, EXP_HEADER7, WSTK_P4, WSTK_P43]
DEBUG_TRACED2: U1.35(PA06)  [also labelled EFR32_PA6, EXP_HEADER11, WSTK_P44, WSTK_P8]
DEBUG_TRACED3: U1.36(PA07)  [also labelled EFR32_PA7, EXP_HEADER13, WSTK_P10, WSTK_P45]
DISP_ENABLE: U1.23(PB05)  [also labelled EFR32_PB05, WSTK_F14, WSTK_P23]
DISP_EXTCOMIN: U1.11(PC09)  [also labelled EFR32_PC09, WSTK_F18, WSTK_P29]
DISP_SCLK: U1.6(PC05)  [also labelled EFR32_PC05, WSTK_F15, WSTK_P33]
DISP_SCS: U1.51(PD05)  [also labelled EFR32_PD05, WSTK_F17, WSTK_P31]
DISP_SI: U1.5(PC04)  [also labelled EFR32_PC04, WSTK_F16, WSTK_P35]
EFR32_PA0: U1.29(PA00) ; off-sheet TP_VCOM_RTS  [also labelled EXP_HEADER5, TP_VCOM_RTS, US0_RTS, VCOM_RTS, WSTK_F9, WSTK_P2]
EFR32_PA8: U1.37(PA08) ; off-sheet TP_VCOM_TX  [also labelled EXP_HEADER12, TP_VCOM_TX, US0_TX, VCOM_TX, WSTK_F6, WSTK_P9]
EFR32_PA9: U1.38(PA09) ; off-sheet TP_VCOM_RX  [also labelled EXP_HEADER14, TP_VCOM_RX, US0_RX, VCOM_RX, WSTK_F7, WSTK_P11]
EFR32_PA10: U1.39(PA10) ; off-sheet TP_VCOM_CTS  [also labelled EXP_HEADER3, TP_VCOM_CTS, US0_CTS, VCOM_CTS, WSTK_F8, WSTK_P0]
EFR32_PA11: U1.40(PA11)  [also labelled VCOM_ENABLE, WSTK_F5, WSTK_P15]
EFR32_PB00: U1.28(PB00)  [also labelled UIF_BUTTON0, WSTK_F12, WSTK_P17]
EFR32_PB01: U1.27(PB01)  [also labelled UIF_BUTTON1, WSTK_F13, WSTK_P21]
EFR32_PB02: U1.26(PB02)  [also labelled EXP_HEADER15, I2C0_SCL, WSTK_P12]
EFR32_PB03: U1.25(PB03)  [also labelled EXP_HEADER16, I2C0_SDA, WSTK_P13]
EFR32_PB04: U1.24(PB04)  [also labelled EXP_HEADER10, US1_CS, WSTK_P7]
EFR32_PC00: RP200.1(R11) U1.1(PC00) U100.D2(SI_/_SIO0) ; off-sheet FLASH_MOSI  [also labelled FLASH_MOSI]
EFR32_PC01: RP200.4(R14) U1.2(PC01) U100.C3(SO_/_SIO1) ; off-sheet FLASH_MISO  [also labelled FLASH_MISO]
EFR32_PC02: RP200.2(R12) U1.3(PC02) U100.E1(SCLK) ; off-sheet FLASH_SCLK  [also labelled FLASH_SCLK]
EFR32_PC03: R103.1 U1.4(PC03) U100.A3(CS#) ; off-sheet FLASH_SCS  [also labelled FLASH_SCS]
EFR32_PC06: U1.7(PC06)  [also labelled UIF_LED0, WSTK_F10, WSTK_P27]
EFR32_PC07: U1.9(PC07)  [also labelled UIF_LED1, WSTK_F11, WSTK_P26]
EFR32_PC08: U1.10(PC08)  [also labelled SENSOR_ENABLE, WSTK_P37]
EFR32_PD00: U1.56(PD00) X2.1  [also labelled LFXTAL_O]
EFR32_PD01: U1.55(PD01) X2.2  [also labelled LFXTAL_I]
EFR32_PD02: R216.2 R217.1 U1.54(PD02)
EFR32_PD03: U1.53(PD03)  [also labelled FRC_DOUT#6, PTI_DATA, WSTK_F20, WSTK_P25]
EFR32_PD04: U1.52(PD04)  [also labelled FRC_DFRAME#6, PTI_SYNC, WSTK_F19, WSTK_P24]
EFR32_PD06: U1.49(PD06) ; off-sheet USB_DP  [also labelled USB_DP]
EFR32_PD07: U1.48(PD07) ; off-sheet USB_DM  [also labelled USB_DM]
EXP_HEADER4: RP200.8(R18)  [also labelled US1_TX, WSTK_P1]
EXP_HEADER6: RP200.5(R15)  [also labelled US1_RX, WSTK_P3]
EXP_HEADER8: RP200.7(R17)  [also labelled US1_CLK, WSTK_P5]
EXP_HEADER9: R216.1  [also labelled WSTK_P6]
JOYSTICK: R217.2  [also labelled WSTK_P36]
NetP2_1: P2.1(SIGNAL) U1.12(HFCLKOUT)

Not connected (* = marked no-connect by the designer): RP200 3(R13) 6(R16); U100 C1(RESET#_/_SIO3)

### Notes on the sheet
- Pin Mapping
- I/O Port Pins
- EFR32 Pin
- EFR32 Peripheral
- EXP Header
  Connection
- WSTK
  Breakout Pin
- WSTK Peripheral
  Connection
- (near RP200) Serial resistors on SPI interface to mitigate any
  signal integrity issues that might arise when an
  unknown load is connected to the expansion header.
- Serial Flash
- Low Frequency Crystal
- (near R217) Overlay
  pads of
  R216/R217
- (in symbol TitleBlock_SiliconLabs_A3) Board Name; Page Title; Designed; Approved; Board Number; Revision; Size; Sheet Modified Date; Sheet; COPYRIGHT SILICON LABORATORIES INC. 2020          CONFIDENTIAL – SUBJECT TO TERMS OF USE; of

### Library data of the parts
*#6 = TitleBlock_SiliconLabs_A3: Board Approver: RGU; OrgName: Silicon Labs
C124 C207 = C0201: Rating: 16V; Tolerance: 20%; Technology: X7S
P2 = KLS_U.FL: Mfg: KLS; Mfg #: L-KLS1-IPEX-20279-001E-01; Price_1K: 0.70
R103 = R0201: Price_1K: 0.005
R216 R217 = R0402: Price_1K: 0.005
RP200 = MNR04M0APJ101: Mfg: ROHM; Mfg #: MNR04M0APJ101; Price_1K: 0.0122
U1 = EFR32xG25_QFN56_HFCLKOUT: as U1 on sheet 02_ RF & Power
U100 = MX25R8035: Mfg #: MX25R8035FBDIL0; Mfg: Macronix; Price_1K: 0.25
X2 = CM8V-T1A: Mfg #: CM8V-T1A-32.768KHZ-7PF-20PPM-TA-QC; Mfg: Micro Crystal AG; Price_1K: 0.3

## Sheet 05_ WSTK Connectors & B.SchDoc
size 420 x 297 mm
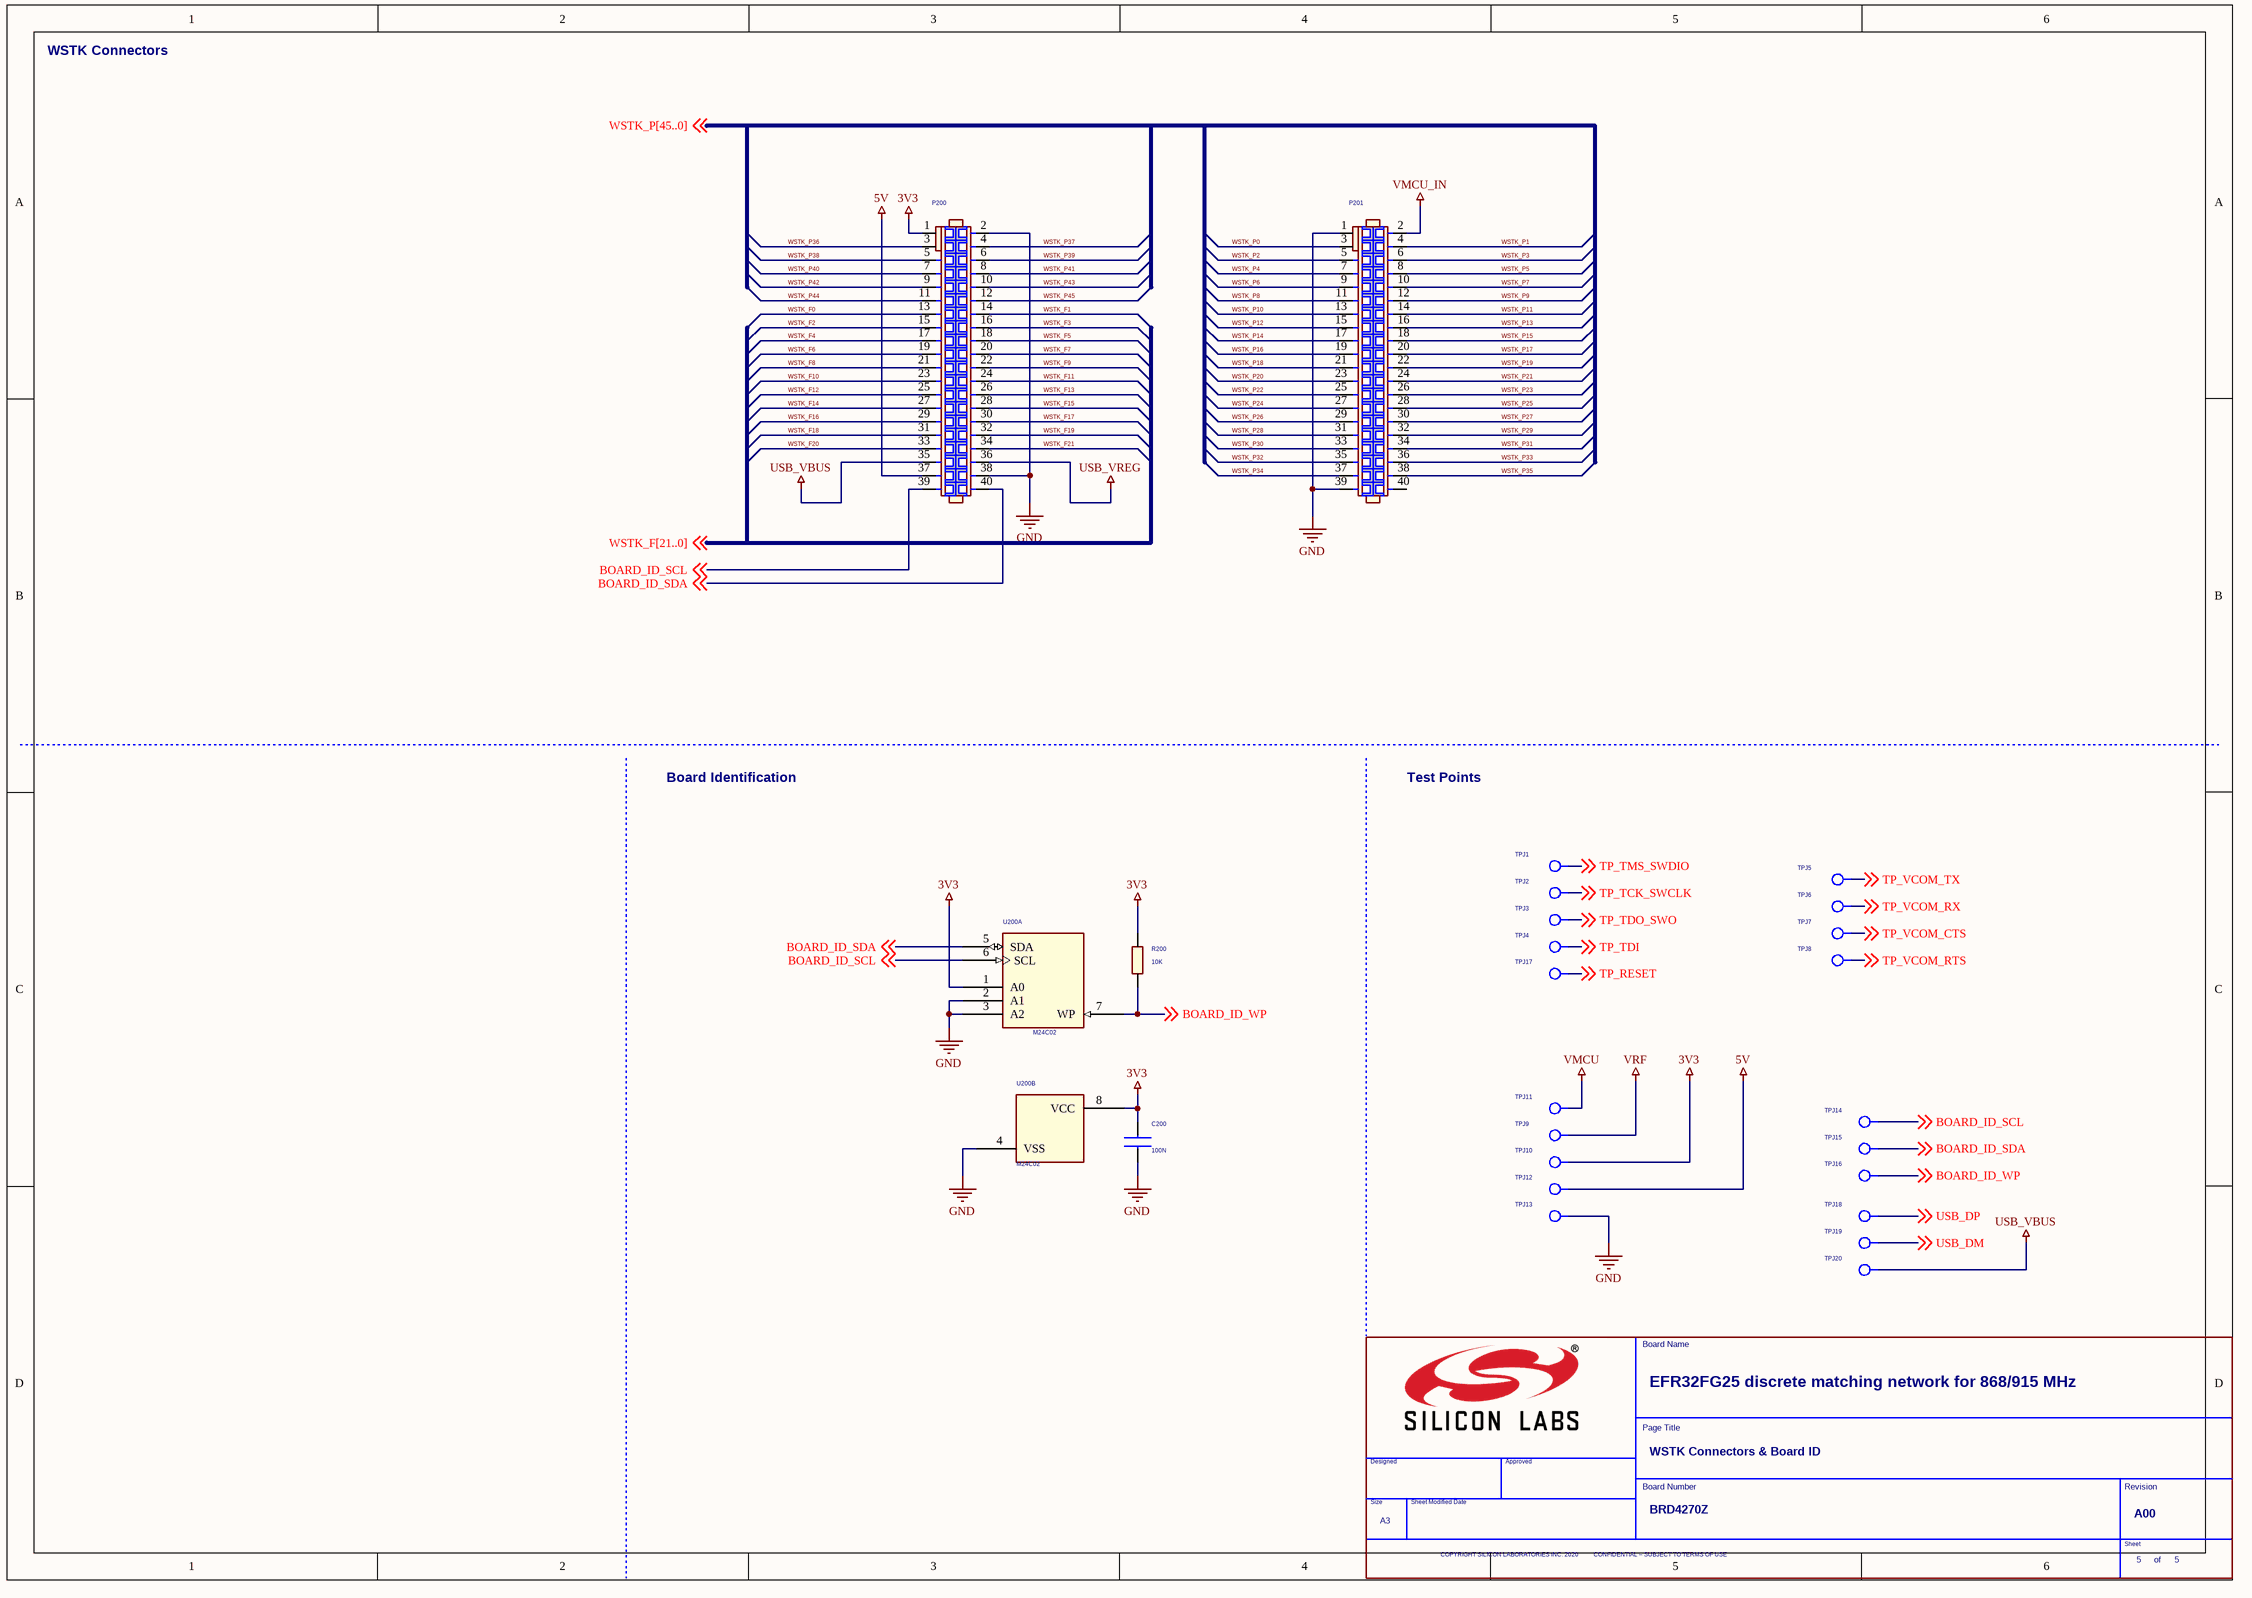
[diagram p9: 05_ WSTK Connectors & B.SchDoc]

### Parts
(Parts that share a designator on the sheet are numbered #1, #2 ... from top to bottom, then left to right.)
*#7  Title: EFR32FG25 discrete matching network for 868/915 MHz  Page Count: 5  Page Size: A3  Page Title: WSTK Connectors & Board ID  Board Number: BRD4270Z  RevCode: A00  (hidden comment: TitleBlock_SiliconLabs_A3)  (graphical)
C200  100N  [C0201_L]
P200  SOCKET_WCON_2X20_1.27MM_SMD  [SAM_SFC-120-T2-D-A-2X20_SNUM]  (value not drawn)
P201  SOCKET_WCON_2X20_1.27MM_SMD  [SAM_SFC-120-T2-D-A-2X20_SNUM]  (value not drawn)
R200  10K  [R0201_L]
TPJ1  TPJ_SMD  [TP_1.0_SMD]  (value not drawn)
TPJ2  TPJ_SMD  [TP_1.0_SMD]  (value not drawn)
TPJ3  TPJ_SMD  [TP_1.0_SMD]  (value not drawn)
TPJ4  TPJ_SMD  [TP_1.0_SMD]  (value not drawn)
TPJ5  TPJ_SMD  [TP_1.0_SMD]  (value not drawn)
TPJ6  TPJ_SMD  [TP_1.0_SMD]  (value not drawn)
TPJ7  TPJ_SMD  [TP_1.0_SMD]  (value not drawn)
TPJ8  TPJ_SMD  [TP_1.0_SMD]  (value not drawn)
TPJ9  TPJ_SMD  [TP1MM_SMD]  (value not drawn)
TPJ10  TPJ_SMD  [TP1MM_SMD]  (value not drawn)
TPJ11  TPJ_SMD  [TP1MM_SMD]  (value not drawn)
TPJ12  TPJ_SMD  [TP1MM_SMD]  (value not drawn)
TPJ13  TPJ_SMD  [TP1MM_SMD]  (value not drawn)
TPJ14  TPJ_SMD  [TP1MM_SMD]  (value not drawn)
TPJ15  TPJ_SMD  [TP1MM_SMD]  (value not drawn)
TPJ16  TPJ_SMD  [TP1MM_SMD]  (value not drawn)
TPJ17  TPJ_SMD  [TP_1.0_SMD]  (value not drawn)
TPJ18  TPJ_SMD  [TP1MM_SMD]  (value not drawn)
TPJ19  TPJ_SMD  [TP1MM_SMD]  (value not drawn)
TPJ20  TPJ_SMD  [TP1MM_SMD]  (value not drawn)
U200  M24C02  [TDFN8_M050_2.0X3.0_EP]  (parts A,B of 2)

### Nets
3V3: C200.1 P200.1 R200.2 TPJ10.1(TP) U200.1(A0) U200.8(VCC)
5V: P200.37 TPJ12.1(TP)
GND: C200.2 P200.2 P200.38 P201.1 P201.39 TPJ13.1(TP) U200.2(A1) U200.3(A2) U200.4(VSS)
USB_VBUS: P200.35 TPJ20.1(TP)
USB_VREG: P200.36
VMCU: TPJ11.1(TP)
VMCU_IN: P201.2
VRF: TPJ9.1(TP)
BOARD_ID_SCL: P200.39 TPJ14.1(TP) U200.6(SCL) ; off-sheet BOARD_ID_SCL
BOARD_ID_SDA: P200.40 TPJ15.1(TP) U200.5(SDA) ; off-sheet BOARD_ID_SDA
BOARD_ID_WP: R200.1 TPJ16.1(TP) U200.7(WP) ; off-sheet BOARD_ID_WP
TP_RESET: P200.17 TPJ17.1(TP) ; off-sheet TP_RESET  [also labelled WSTK_F4]  [project net DBG_RESET]
TP_TCK_SWCLK: P200.14 P201.23 TPJ2.1(TP) ; off-sheet TP_TCK_SWCLK  [also labelled WSTK_F1, WSTK_P20]  [project net DBG_SWCLK]
TP_TDI: P200.8 P200.16 P201.17 TPJ4.1(TP) ; off-sheet TP_TDI  [also labelled WSTK_F3, WSTK_P14, WSTK_P41]  [project net DBG_TDI]
TP_TDO_SWO: P200.9 P200.15 P201.19 TPJ3.1(TP) ; off-sheet TP_TDO_SWO  [also labelled WSTK_F2, WSTK_P16, WSTK_P42]  [project net DBG_SWO / DBG_TDO]
TP_TMS_SWDIO: P200.13 P201.21 TPJ1.1(TP) ; off-sheet TP_TMS_SWDIO  [also labelled WSTK_F0, WSTK_P18]  [project net DBG_SWDIOTMS]
TP_VCOM_CTS: P200.21 P201.3 TPJ7.1(TP) ; off-sheet TP_VCOM_CTS  [also labelled WSTK_F8, WSTK_P0]  [project net EFR32_PA10]
TP_VCOM_RTS: P200.22 P201.5 TPJ8.1(TP) ; off-sheet TP_VCOM_RTS  [also labelled WSTK_F9, WSTK_P2]  [project net EFR32_PA0]
TP_VCOM_RX: P200.20 P201.14 TPJ6.1(TP) ; off-sheet TP_VCOM_RX  [also labelled WSTK_F7, WSTK_P11]  [project net EFR32_PA9]
TP_VCOM_TX: P200.19 P201.12 TPJ5.1(TP) ; off-sheet TP_VCOM_TX  [also labelled WSTK_F6, WSTK_P9]  [project net EFR32_PA8]
USB_DM: TPJ19.1(TP) ; off-sheet USB_DM  [project net EFR32_PD07]
USB_DP: TPJ18.1(TP) ; off-sheet USB_DP  [project net EFR32_PD06]
WSTK_F5: P200.18 P201.18  [also labelled WSTK_P15]  [project net EFR32_PA11]
WSTK_F10: P200.23 P201.30  [also labelled WSTK_P27]  [project net EFR32_PC06]
WSTK_F11: P200.24 P201.29  [also labelled WSTK_P26]  [project net EFR32_PC07]
WSTK_F12: P200.25 P201.20  [also labelled WSTK_P17]  [project net EFR32_PB00]
WSTK_F13: P200.26 P201.24  [also labelled WSTK_P21]  [project net EFR32_PB01]
WSTK_F14: P200.27 P201.26  [also labelled WSTK_P23]  [project net DISP_ENABLE]
WSTK_F15: P200.28 P201.36  [also labelled WSTK_P33]  [project net DISP_SCLK]
WSTK_F16: P200.29 P201.38  [also labelled WSTK_P35]  [project net DISP_SI]
WSTK_F17: P200.30 P201.34  [also labelled WSTK_P31]  [project net DISP_SCS]
WSTK_F18: P200.31 P201.32  [also labelled WSTK_P29]  [project net DISP_EXTCOMIN]
WSTK_F19: P200.32 P201.27  [also labelled WSTK_P24]  [project net EFR32_PD04]
WSTK_F20: P200.33 P201.28  [also labelled WSTK_P25]  [project net EFR32_PD03]
WSTK_F21: P200.34
WSTK_P1: P201.4  [project net EXP_HEADER4]
WSTK_P3: P201.6  [project net EXP_HEADER6]
WSTK_P4: P200.10 P201.7  [also labelled WSTK_P43]  [project net DEBUG_TRACED1]
WSTK_P5: P201.8  [project net EXP_HEADER8]
WSTK_P6: P201.9  [project net EXP_HEADER9]
WSTK_P7: P201.10  [project net EFR32_PB04]
WSTK_P10: P200.12 P201.13  [also labelled WSTK_P45]  [project net DEBUG_TRACED3]
WSTK_P12: P201.15  [project net EFR32_PB02]
WSTK_P13: P201.16  [project net EFR32_PB03]
WSTK_P19: P201.22
WSTK_P22: P201.25
WSTK_P28: P201.31
WSTK_P30: P201.33
WSTK_P32: P201.35
WSTK_P34: P201.37
WSTK_P36: P200.3  [project net JOYSTICK]
WSTK_P37: P200.4  [project net EFR32_PC08]
WSTK_P38: P200.5
WSTK_P39: P200.6
WSTK_P40: P200.7
WSTK_P44: P200.11 P201.11  [also labelled WSTK_P8]  [project net DEBUG_TRACED2]

Not connected (* = marked no-connect by the designer): P201 40

### Notes on the sheet
- WSTK Connectors
- Board Identification
- Test Points
- (in symbol TitleBlock_SiliconLabs_A3) Board Name; Page Title; Designed; Approved; Board Number; Revision; Size; Sheet Modified Date; Sheet; COPYRIGHT SILICON LABORATORIES INC. 2020          CONFIDENTIAL – SUBJECT TO TERMS OF USE; of

### Library data of the parts
C200 = C0201: Rating: 16V; Tolerance: 20%; Technology: X7S
P200 P201 = SOCKET_WCON_2X20_1.27MM_SMD: Mfg: WCON; Mfg #: 2344-220MS3CUNR6; Price_1K: 3.44
R200 = R0201: Price_1K: 0.005
TPJ1-TPJ8 TPJ17 = TPJ_SMD_Dup1
U200 = M24C02: Mfg #: M24C02-FMC6TG; Mfg: ST Microelectronics; CONTEC Footprint: MSOP8_M065_W3.0; Price_1K: 0.06
*#7 = TitleBlock_SiliconLabs_A3: Page Number: 5; OrgName: Silicon Labs

## Nets that join several sheets
5V: 03_ Board Power (D902.2), 05_ WSTK Connectors & B (P200.37 TPJ12.1)
GND: 02_ RF & Power (36 pins), 03_ Board Power (25 pins), 04_ EFR32 Signal Assign (5 pins), 05_ WSTK Connectors & B (9 pins)
USB_VBUS: 03_ Board Power (D901.2 D903.2 L901.2), 05_ WSTK Connectors & B (P200.35 TPJ20.1)
USB_VREG: 03_ Board Power (D903.4 R202.2 R243.1 R248.2), 05_ WSTK Connectors & B (P200.36)
V_IOVDD2: 02_ RF & Power (C118.1 C119.1 U1.50), 03_ Board Power (D903.3)
VLDO_3V6: 02_ RF & Power (R211.1), 03_ Board Power (R247.2)
VMCU: 02_ RF & Power (7 pins), 03_ Board Power (C203.1 C205.1 R201.1 R202.1), 04_ EFR32 Signal Assign (C124.1 R103.2 U100.A1 U100.E3), 05_ WSTK Connectors & B (TPJ11.1)
VMCU_IN: 03_ Board Power (C201.1 R201.2), 05_ WSTK Connectors & B (P201.2)
DBG_RESET: 02_ RF & Power (U1.15), 04_ EFR32 Signal Assign (C207.1), 05_ WSTK Connectors & B (P200.17 TPJ17.1)
DBG_SWCLK: 04_ EFR32 Signal Assign (U1.30), 05_ WSTK Connectors & B (P200.14 P201.23 TPJ2.1)
DBG_SWDIOTMS: 04_ EFR32 Signal Assign (U1.31), 05_ WSTK Connectors & B (P200.13 P201.21 TPJ1.1)
DBG_SWO / DBG_TDO: 04_ EFR32 Signal Assign (U1.32), 05_ WSTK Connectors & B (P200.9 P200.15 P201.19 TPJ3.1)
DBG_TDI: 04_ EFR32 Signal Assign (U1.33), 05_ WSTK Connectors & B (P200.8 P200.16 P201.17 TPJ4.1)
DEBUG_TRACED1: 04_ EFR32 Signal Assign (U1.34), 05_ WSTK Connectors & B (P200.10 P201.7)
DEBUG_TRACED2: 04_ EFR32 Signal Assign (U1.35), 05_ WSTK Connectors & B (P200.11 P201.11)
DEBUG_TRACED3: 04_ EFR32 Signal Assign (U1.36), 05_ WSTK Connectors & B (P200.12 P201.13)
DISP_ENABLE: 04_ EFR32 Signal Assign (U1.23), 05_ WSTK Connectors & B (P200.27 P201.26)
DISP_EXTCOMIN: 04_ EFR32 Signal Assign (U1.11), 05_ WSTK Connectors & B (P200.31 P201.32)
DISP_SCLK: 04_ EFR32 Signal Assign (U1.6), 05_ WSTK Connectors & B (P200.28 P201.36)
DISP_SCS: 04_ EFR32 Signal Assign (U1.51), 05_ WSTK Connectors & B (P200.30 P201.34)
DISP_SI: 04_ EFR32 Signal Assign (U1.5), 05_ WSTK Connectors & B (P200.29 P201.38)
EFR32_PA0: 04_ EFR32 Signal Assign (U1.29), 05_ WSTK Connectors & B (P200.22 P201.5 TPJ8.1)
EFR32_PA8: 04_ EFR32 Signal Assign (U1.37), 05_ WSTK Connectors & B (P200.19 P201.12 TPJ5.1)
EFR32_PA9: 04_ EFR32 Signal Assign (U1.38), 05_ WSTK Connectors & B (P200.20 P201.14 TPJ6.1)
EFR32_PA10: 04_ EFR32 Signal Assign (U1.39), 05_ WSTK Connectors & B (P200.21 P201.3 TPJ7.1)
EFR32_PA11: 04_ EFR32 Signal Assign (U1.40), 05_ WSTK Connectors & B (P200.18 P201.18)
EFR32_PB00: 04_ EFR32 Signal Assign (U1.28), 05_ WSTK Connectors & B (P200.25 P201.20)
EFR32_PB01: 04_ EFR32 Signal Assign (U1.27), 05_ WSTK Connectors & B (P200.26 P201.24)
EFR32_PB02: 04_ EFR32 Signal Assign (U1.26), 05_ WSTK Connectors & B (P201.15)
EFR32_PB03: 04_ EFR32 Signal Assign (U1.25), 05_ WSTK Connectors & B (P201.16)
EFR32_PB04: 04_ EFR32 Signal Assign (U1.24), 05_ WSTK Connectors & B (P201.10)
EFR32_PC06: 04_ EFR32 Signal Assign (U1.7), 05_ WSTK Connectors & B (P200.23 P201.30)
EFR32_PC07: 04_ EFR32 Signal Assign (U1.9), 05_ WSTK Connectors & B (P200.24 P201.29)
EFR32_PC08: 04_ EFR32 Signal Assign (U1.10), 05_ WSTK Connectors & B (P200.4)
EFR32_PD03: 04_ EFR32 Signal Assign (U1.53), 05_ WSTK Connectors & B (P200.33 P201.28)
EFR32_PD04: 04_ EFR32 Signal Assign (U1.52), 05_ WSTK Connectors & B (P200.32 P201.27)
EFR32_PD06: 03_ Board Power (D900.4 P900.3), 04_ EFR32 Signal Assign (U1.49), 05_ WSTK Connectors & B (TPJ18.1)
EFR32_PD07: 03_ Board Power (D900.5 P900.2), 04_ EFR32 Signal Assign (U1.48), 05_ WSTK Connectors & B (TPJ19.1)
EXP_HEADER4: 04_ EFR32 Signal Assign (RP200.8), 05_ WSTK Connectors & B (P201.4)
EXP_HEADER6: 04_ EFR32 Signal Assign (RP200.5), 05_ WSTK Connectors & B (P201.6)
EXP_HEADER8: 04_ EFR32 Signal Assign (RP200.7), 05_ WSTK Connectors & B (P201.8)
EXP_HEADER9: 04_ EFR32 Signal Assign (R216.1), 05_ WSTK Connectors & B (P201.9)
JOYSTICK: 04_ EFR32 Signal Assign (R217.2), 05_ WSTK Connectors & B (P200.3)